# Altium project Capstone_SDR_PLUTOV2.PrjPcb (part 2 of 3)

## Sheet AD9363.SchDoc
size A3; SheetNumber: 6; SheetTotal: 14; SPICEModelCachePHHWHPTQ: <root> / <DocumentId>PHHWHPTQ</DocumentId> / <CacheFrame Number="0"> / <Model Name="emk105bj105_v-f" Kind="CKT"> / <Text>* EMK105BJ105_V-F     SPICE MODEL  ( General Type ) / *-------------------------------------------------------------------------------------------------------- / * Model Generated by TAIYO YUDEN Corporation (http://www.ty-top.com) / * Version 1.0 / * TAIYO YUDEN Control No. 170508_130520 / * Copyright(c) 2012 TAIYO YUDEN CO.,LTD. All Rights Reserved. / *-------------------------------------------------------------------------------------------------------- / * / * Products Name : Multilayer Ceramic Capacitors / * / * Characteristics : / *     Capacitance : 1 uF , Rated Voltage : 16V , TCC : X5R / *     Case Size : 1.0 x 0.5 / 0.039 x 0.02 [mm/inch] , Thickness : 0.5 / 0.02 [mm/inch] / *     (Conditions: Temperature = 25 degC , DC Bias Current/Voltage = 0A / 0V) / * / * Frequency Range : 40Hz - 3GHz / * / * External Node Assignments : / * / *  1  o---| |---o  2 / * / *-------------------------------------------------------------------------------------------------------- / .SubCkt EMK105BJ105_V-F 1 2 / **************************** / C0 1 110 0.68309u / Cm 1 101 0.26053u / C1 101 102 0.94076u / Rc1 101 102 1.9029k / C2 102 103 0.66707u / Rc2 102 103 120.36 / C3 103 110 0.57203u / Rc3 103 110 2.1097 / C2m 1 301 0.1871u / C21 301 302 3.2494u / Rc21 301 302 1.1117k / C22 302 303 2.1014u / Rc22 302 303 1.484k / C23 303 304 2.1172u / Rc23 303 304 1.3876k / C24 304 305 0.75729u / Rc24 304 305 332.59 / C25 305 306 0.94401u / Rc25 305 306 249.09 / C26 306 307 0.34674u / Rc26 306 307 28.352 / C27 307 308 0.37158u / Rc27 307 308 19.989 / C28 308 309 0.17933u / Rc28 308 309 31.748 / C29 309 110 0.016445u / Rc29 309 110 1.0592 / Rp0 1 110 100Meg / L0 110 120 0.2216n / Lm 120 130 0.1509n / L1 120 121 0.12659n / RL1 121 130 0.85161 / L2 120 122 0.15996n / RL2 122 130 0.42469 / L3 120 123 7.9543n / RL3 123 130 0.54643m / CR 120 124 0.24334u / LR 124 125 0.090738n / RR 125 130 68.076m / CL 130 140 2.7354p / LL 130 140 0.10762n / RL 130 140 50.614 / Rs 140 2 7.5416m / **************************** / .ends EMK105BJ105_V-F</Text> / </Model> / </CacheFrame> / </root>
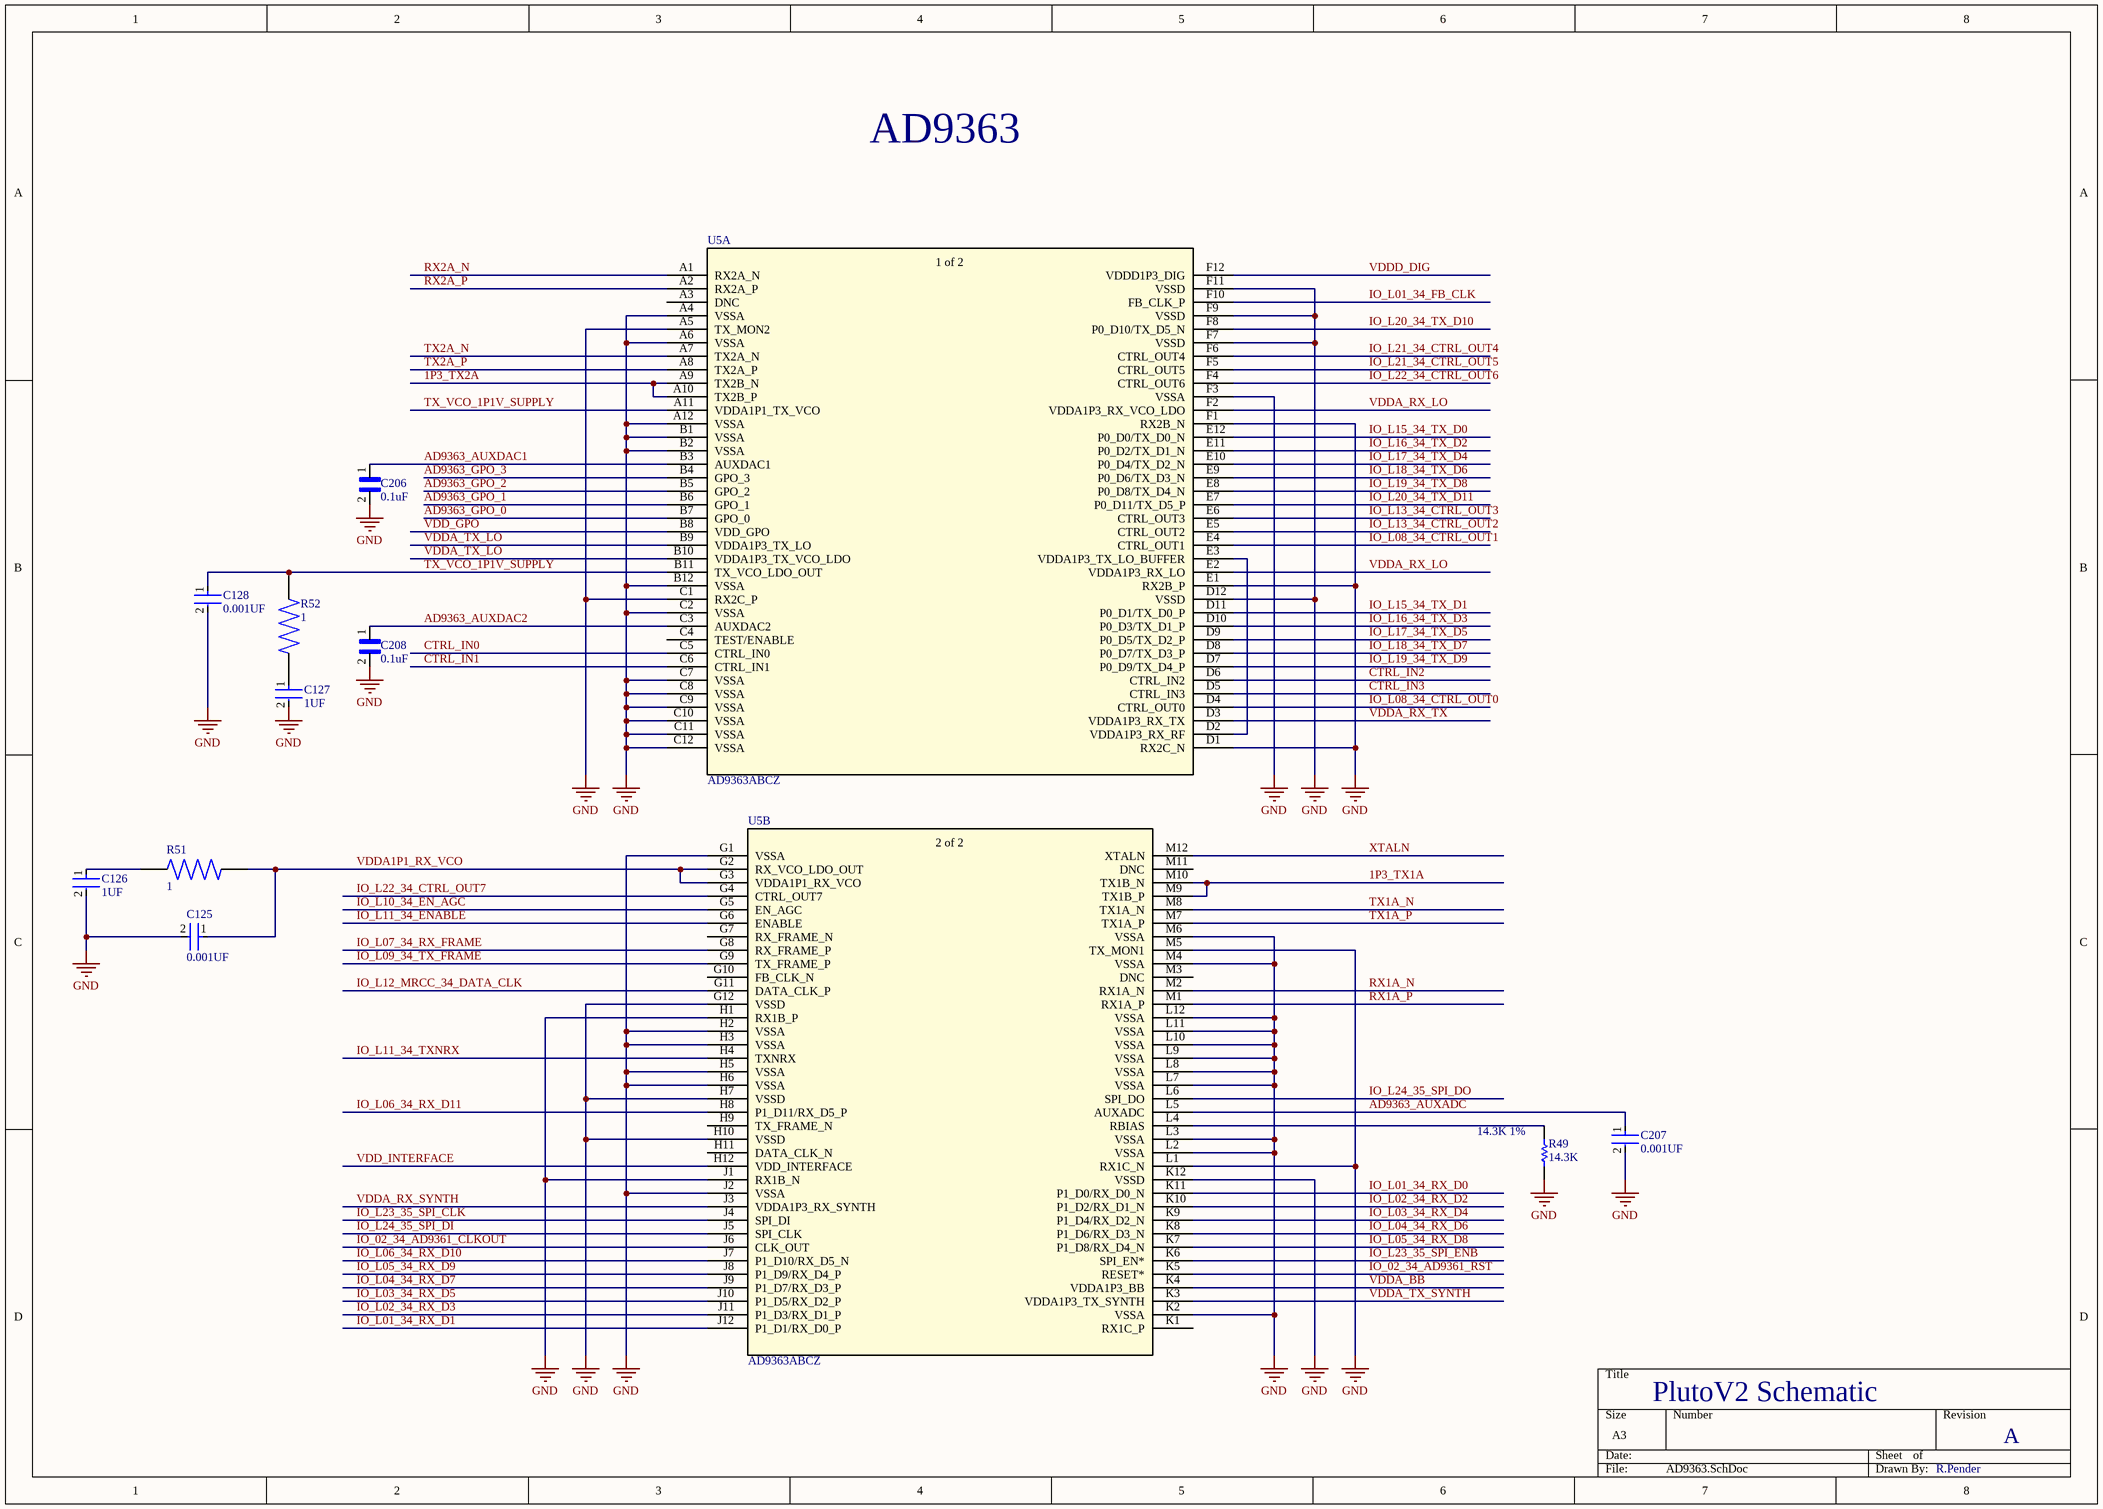
[diagram p5: AD9363.SchDoc]

### Parts
C125  0.001UF  [FP-GRM033-0_03-MFG]
C126  1UF  [FP-0402-L_1_0_0_05-W_0_5-IPC_A]
C127  1UF  [FP-0402-L_1_0_0_05-W_0_5-IPC_A]
C128  0.001UF  [FP-GRM033-0_03-MFG]
C206  0.1uF  [CAPC0603X33N]
C207  0.001UF  [FP-GRM033-0_03-MFG]
C208  0.1uF  [CAPC0603X33N]
R49  14.3K  [RESC0603X26X15NL03T05]
R51  1  [RESC0603X26N]
R52  1  [RESC0603X26N]
U5  AD9363ABCZ  [BGA144C80P12X12_1000X1000X170]  (parts A,B of 2)

### Nets
GND: C125.2 C126.2 C127.2 C128.2 C206.2 C207.2 C208.2 R49.2 U5.A4(VSSA) U5.A5(TX_MON2) U5.A6(VSSA) U5.A12(VSSA) U5.B1(VSSA) U5.B2(VSSA) U5.B12(VSSA) U5.C1(RX2C_P) U5.C2(VSSA) U5.C7(VSSA) U5.C8(VSSA) U5.C9(VSSA) U5.C10(VSSA) U5.C11(VSSA) U5.C12(VSSA) U5.D1(RX2C_N) U5.D12(VSSD) U5.E1(RX2B_P) U5.F1(RX2B_N) U5.F3(VSSA) U5.F7(VSSD) U5.F9(VSSD) U5.F11(VSSD) U5.G1(VSSA) U5.G12(VSSD) U5.H1(RX1B_P) U5.H2(VSSA) U5.H3(VSSA) U5.H5(VSSA) U5.H6(VSSA) U5.H7(VSSD) U5.H10(VSSD) U5.J1(RX1B_N) U5.J2(VSSA) U5.K2(VSSA) U5.K12(VSSD) U5.L1(RX1C_N) U5.L2(VSSA) U5.L3(VSSA) U5.L7(VSSA) U5.L8(VSSA) U5.L9(VSSA) U5.L10(VSSA) U5.L11(VSSA) U5.L12(VSSA) U5.M4(VSSA) U5.M5(TX_MON1) U5.M6(VSSA)
1P3_TX1A: U5.A9(TX2B_N) U5.A10(TX2B_P) U5.F12(VDDD1P3_DIG) U5.J3(VDDA1P3_RX_SYNTH) U5.K4(VDDA1P3_BB) U5.M9(TX1B_P) U5.M10(TX1B_N)  [also labelled 1P3_TX2A, VDDA_BB, VDDA_RX_SYNTH, VDDD_DIG]  [project net 1P3_SUPPLY_B]
AD9363_AUXADC: C207.1 U5.L5(AUXADC)
AD9363_AUXDAC1: C206.1 U5.B3(AUXDAC1)
AD9363_AUXDAC2: C208.1 U5.C3(AUXDAC2)
AD9363_GPO_0: U5.B7(GPO_0)
AD9363_GPO_1: U5.B6(GPO_1)
AD9363_GPO_2: U5.B5(GPO_2)
AD9363_GPO_3: U5.B4(GPO_3)
CTRL_IN0: U5.C5(CTRL_IN0)
CTRL_IN1: U5.C6(CTRL_IN1)
CTRL_IN2: U5.D6(CTRL_IN2)
CTRL_IN3: U5.D5(CTRL_IN3)
IO_02_34_AD9361_CLKOUT: U5.J6(CLK_OUT)
IO_02_34_AD9361_RST: U5.K5(RESET*)
IO_L01_34_FB_CLK: U5.F10(FB_CLK_P)
IO_L01_34_RX_D0: U5.K11(P1_D0/RX_D0_N)
IO_L01_34_RX_D1: U5.J12(P1_D1/RX_D0_P)
IO_L02_34_RX_D2: U5.K10(P1_D2/RX_D1_N)
IO_L02_34_RX_D3: U5.J11(P1_D3/RX_D1_P)
IO_L03_34_RX_D4: U5.K9(P1_D4/RX_D2_N)
IO_L03_34_RX_D5: U5.J10(P1_D5/RX_D2_P)
IO_L04_34_RX_D6: U5.K8(P1_D6/RX_D3_N)
IO_L04_34_RX_D7: U5.J9(P1_D7/RX_D3_P)
IO_L05_34_RX_D8: U5.K7(P1_D8/RX_D4_N)
IO_L05_34_RX_D9: U5.J8(P1_D9/RX_D4_P)
IO_L06_34_RX_D10: U5.J7(P1_D10/RX_D5_N)
IO_L06_34_RX_D11: U5.H8(P1_D11/RX_D5_P)
IO_L07_34_RX_FRAME: U5.G8(RX_FRAME_P)
IO_L08_34_CTRL_OUT0: U5.D4(CTRL_OUT0)
IO_L08_34_CTRL_OUT1: U5.E4(CTRL_OUT1)
IO_L09_34_TX_FRAME: U5.G9(TX_FRAME_P)
IO_L10_34_EN_AGC: U5.G5(EN_AGC)
IO_L11_34_ENABLE: U5.G6(ENABLE)
IO_L11_34_TXNRX: U5.H4(TXNRX)
IO_L12_MRCC_34_DATA_CLK: U5.G11(DATA_CLK_P)
IO_L13_34_CTRL_OUT2: U5.E5(CTRL_OUT2)
IO_L13_34_CTRL_OUT3: U5.E6(CTRL_OUT3)
IO_L15_34_TX_D0: U5.E12(P0_D0/TX_D0_N)
IO_L15_34_TX_D1: U5.D11(P0_D1/TX_D0_P)
IO_L16_34_TX_D2: U5.E11(P0_D2/TX_D1_N)
IO_L16_34_TX_D3: U5.D10(P0_D3/TX_D1_P)
IO_L17_34_TX_D4: U5.E10(P0_D4/TX_D2_N)
IO_L17_34_TX_D5: U5.D9(P0_D5/TX_D2_P)
IO_L18_34_TX_D6: U5.E9(P0_D6/TX_D3_N)
IO_L18_34_TX_D7: U5.D8(P0_D7/TX_D3_P)
IO_L19_34_TX_D8: U5.E8(P0_D8/TX_D4_N)
IO_L19_34_TX_D9: U5.D7(P0_D9/TX_D4_P)
IO_L20_34_TX_D10: U5.F8(P0_D10/TX_D5_N)
IO_L20_34_TX_D11: U5.E7(P0_D11/TX_D5_P)
IO_L21_34_CTRL_OUT4: U5.F6(CTRL_OUT4)
IO_L21_34_CTRL_OUT5: U5.F5(CTRL_OUT5)
IO_L22_34_CTRL_OUT6: U5.F4(CTRL_OUT6)
IO_L22_34_CTRL_OUT7: U5.G4(CTRL_OUT7)
IO_L23_35_SPI_CLK: U5.J4(SPI_DI)
IO_L23_35_SPI_ENB: U5.K6(SPI_EN*)
IO_L24_35_SPI_DI: U5.J5(SPI_CLK)
IO_L24_35_SPI_DO: U5.L6(SPI_DO)
RX1A_N: U5.M2(RX1A_N)
RX1A_P: U5.M1(RX1A_P)
RX2A_N: U5.A1(RX2A_N)
RX2A_P: U5.A2(RX2A_P)
TX1A_N: U5.M8(TX1A_N)
TX1A_P: U5.M7(TX1A_P)
TX2A_N: U5.A7(TX2A_N)
TX2A_P: U5.A8(TX2A_P)
TX_VCO_1P1V_SUPPLY: C128.1 R52.1 U5.A11(VDDA1P1_TX_VCO) U5.B11(TX_VCO_LDO_OUT)
VDD_GPO: U5.B8(VDD_GPO)  [project net 3P3V]
VDD_INTERFACE: U5.H12(VDD_INTERFACE)
VDDA1P1_RX_VCO: C125.1 R51.2 U5.G2(RX_VCO_LDO_OUT) U5.G3(VDDA1P1_RX_VCO)
VDDA_RX_LO: U5.B9(VDDA1P3_TX_LO) U5.B10(VDDA1P3_TX_VCO_LDO) U5.D3(VDDA1P3_RX_TX) U5.E2(VDDA1P3_RX_LO) U5.F2(VDDA1P3_RX_VCO_LDO) U5.K3(VDDA1P3_TX_SYNTH)  [also labelled VDDA_RX_TX, VDDA_TX_LO, VDDA_TX_SYNTH]  [project net 1P3_SUPPLY_A]
XTALN: U5.M12(XTALN)
NetC126_1: C126.1 R51.1
NetC127_1: C127.1 R52.2
NetR49_1: R49.1 U5.L4(RBIAS)
NetU5_D2: U5.D2(VDDA1P3_RX_RF) U5.E3(VDDA1P3_TX_LO_BUFFER)

Not connected (* = marked no-connect by the designer): U5 A3(DNC) C4(TEST/ENABLE) G7(RX_FRAME_N) G10(FB_CLK_N) H9(TX_FRAME_N) H11(DATA_CLK_N) K1(RX1C_P) M3(DNC) M11(DNC)

### Notes on the sheet
- AD9363
- (near R49) 14.3K 1%
- PlutoV2 Schematic
- A
- R.Pender
- (in symbol AD9363ABCZ, part A) 1 of 2
- (in symbol AD9363ABCZ, part B) 2 of 2

### Library data of the parts
C125 C128 C207 = CMP-2010-01706-2: Chip Multilayer Ceramic Capacitors for General Purpose, 0201, 1000pF, X7R, 15%, 10%, 25V; Capacitance: 1nF; Max Operating Temperature: 125°C; Material: Ceramic; Lead Free: Lead Free; Radiation Hardening: No; Dielectric: X7R; Height: 0.3mm; Mount: Surface Mount; Packaging: Tape and Reel; Termination: SMD/SMT; Thickness: 0.013inch; Case Code (Metric): 0603; Tolerance: 10%; Voltage Rating (DC): 25V; REACH SVHC: No SVHC; Package Quantity: 1; Depth: 0.3mm; Voltage: 25V; Case/Package: 0201; Case Code (Imperial): 0201; Voltage Rating: 25V; Min Operating Temperature: -55°C; Length: 0.6mm; Width: 0.012inch
C126 C127 = CMP-14477-000104-2: None; Tolerance: 10%; Voltage Rating: 16V; Dielectric: X5R; Packaging: Tape and Reel; Depth: 0.5mm; Mount: Surface Mount; Thickness: 0.022inch; Package Quantity: 1; Min Operating Temperature: -55°C; Series: M; Voltage Rating (DC): 16V; Termination: SMD/SMT; Case/Package: 0402; Number of Pins: 2; Case Code (Imperial): 0402; Capacitance: 1uF; Length: 1mm; Halogen Free: Halogen Free; Case Code (Metric): 1005; Width: 0.02inch; RoHS Compliant: Yes; Radiation Hardening: No; Max Operating Temperature: 85°C; Height: 0.5mm; Construction: Flat
C206 C208 = GRM033R61C104ME84D: as C46 on sheet USB; Package: None; Price: None; Value: *; MP: GRM033R61C104ME84D; Availability: Unavailable
R49 = CMP-1010-00545-2: Manufacturer: Panasonic; Part Number: ERJ-1GNF1432C
R51 R52 = RMCF0201FT1R00: Package: None; Price: None; Value: *; MP: RMCF0201FT1R00; Availability: Unavailable
U5 = AD9363ABCZ: No Description Available; Mfr_Name: Analog Devices Inc; Copyright: Copyright (C) 2022 Ultra Librarian. All rights reserved.; Manufacturer_Part_Number: AD9363ABCZ; Digi-Key_Part_Number_1: AD9363ABCZ-ND; RefDes: RefDes; Type: DEV

## Sheet RF FRONTEND.SchDoc
size A3; SheetNumber: 7; SheetTotal: 14
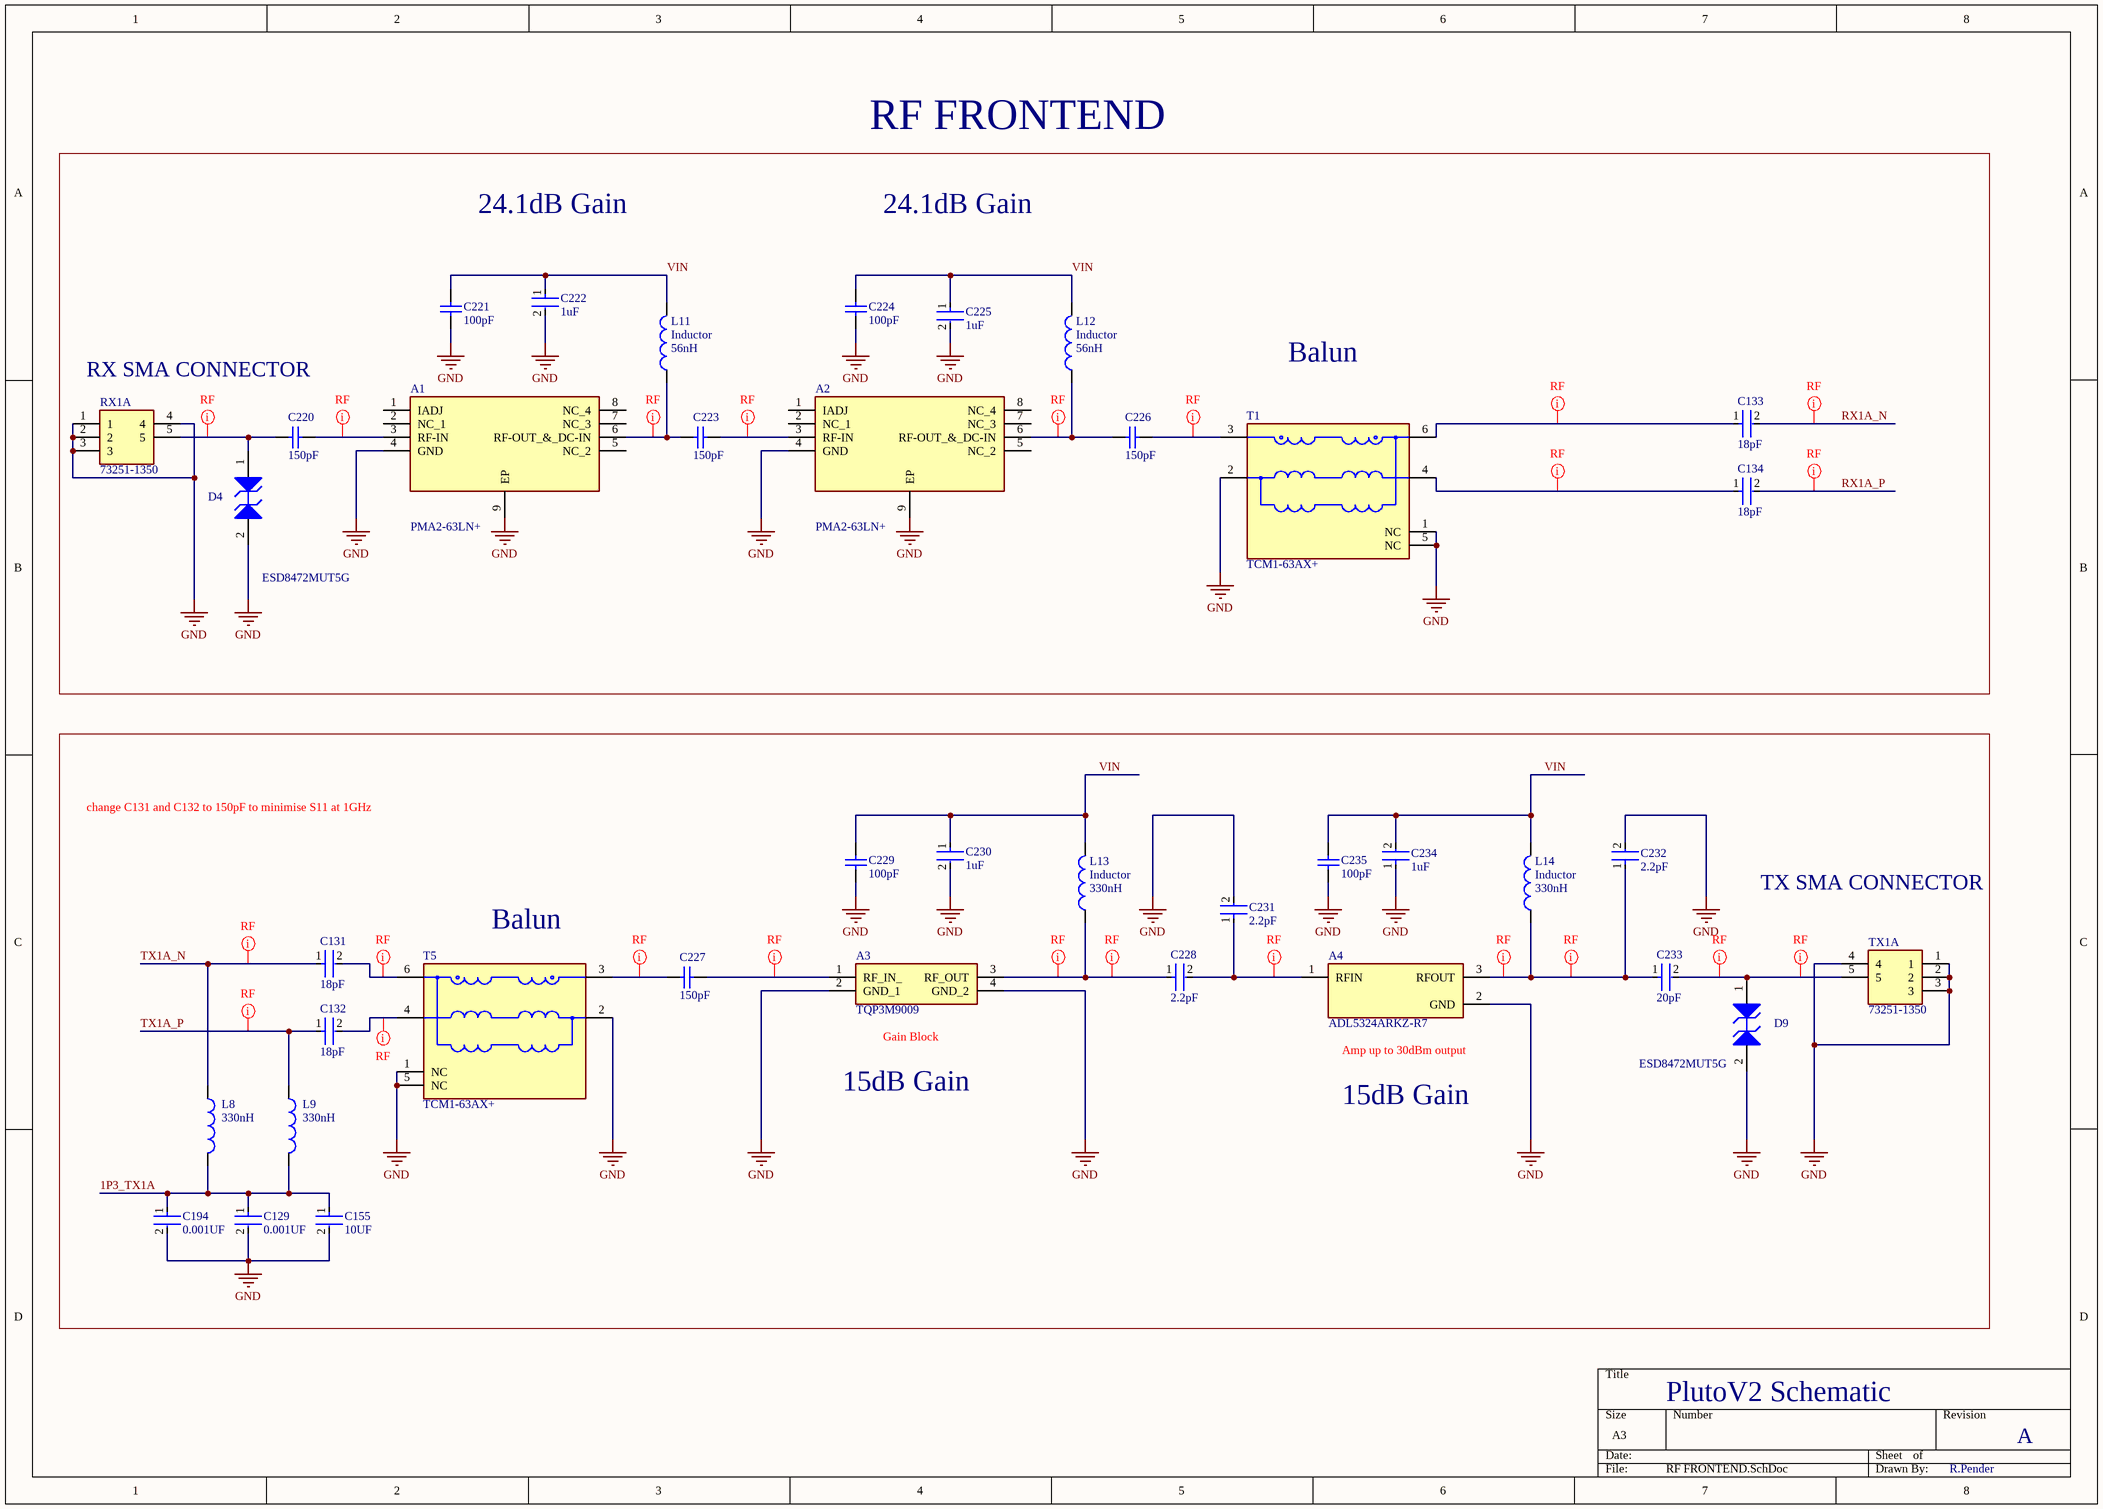
[diagram p6: RF FRONTEND.SchDoc]

### Parts
A1  PMA2-63LN+  [SON50P200X200X105-9N]
A2  PMA2-63LN+  [SON50P200X200X105-9N]
A3  TQP3M9009  [TQP3M9009]
A4  ADL5324ARKZ-R7  [FP-RK-3-MFG]
C129  0.001UF  [FP-GRM033-0_03-MFG]
C131  18pF  [FP-GRM033-0_03-IPC_A]
C132  18pF  [FP-GRM033-0_03-IPC_A]
C133  18pF  [FP-GRM033-0_03-IPC_A]
C134  18pF  [FP-GRM033-0_03-IPC_A]
C155  10UF  [FP-GRM188-0_1-e0_2_0_55-IPC_A]
C194  0.001UF  [FP-GRM033-0_03-MFG]
C220  150pF  [CAPC1005X55X25ML05T10]
C221  100pF  [CAPC1005X55X25ML05T10]
C222  1uF  [FP-GRM155-0_05-IPC_B]
C223  150pF  [CAPC1005X55X25ML05T10]
C224  100pF  [CAPC1005X55X25ML05T10]
C225  1uF  [FP-GRM155-0_05-IPC_B]
C226  150pF  [CAPC1005X55X25ML05T10]
C227  150pF  [CAPC1005X55X25ML05T10]
C228  2.2pF  [FP-GJM155-0_05-MFG]
C229  100pF  [CAPC1005X55X25ML05T10]
C230  1uF  [FP-GRM155-0_05-IPC_B]
C231  2.2pF  [FP-GJM155-0_05-MFG]
C232  2.2pF  [FP-GJM155-0_05-MFG]
C233  20pF  [FP-GJM155-0_05-IPC_C]
C234  1uF  [FP-GRM155-0_05-MFG]
C235  100pF  [CAPC1005X55X25ML05T10]
D4  ESD8472MUT5G  [ONSC-X3DFN-2-152AF-01_V]
D9  ESD8472MUT5G  [ONSC-X3DFN-2-152AF-01_V]
L8  330nH  [0402-A]
L9  330nH  [0402-A]
L11  Inductor  value 56nH  [0402-A]
L12  Inductor  value 56nH  [0402-A]
L13  Inductor  value 330nH  [0402-A]
L14  Inductor  value 330nH  [0402-A]
RX1A  73251-1350  [73251-1350]
T1  TCM1-63AX+  [FP-TCM1-63AX+-MFG]
T5  TCM1-63AX+  [FP-TCM1-63AX+-MFG]
TX1A  73251-1350  [73251-1350]

### Blocks framed on the sheet
RF FRONTEND: A1 A2 C133 C134 C220-C226 D4 L11 L12 RX1A T1

### Nets
GND: A1.4(GND) A1.9(EP) A2.4(GND) A2.9(EP) A3.2(GND_1) A3.4(GND_2) A4.2(GND) C129.2 C155.2 C194.2 C221.2 C222.2 C224.2 C225.2 C229.2 C230.2 C231.2 C232.2 C234.1 C235.1 D4.2(A2) D9.2(A2) RX1A.1 RX1A.2 RX1A.3 RX1A.4 T1.1(NC) T1.2(GND) T1.5(NC) T5.1(NC) T5.2(GND) T5.5(NC) TX1A.1 TX1A.2 TX1A.3 TX1A.4
1P3_TX1A: C129.1 C155.1 C194.1 L8.2 L9.2  [project net 1P3_SUPPLY_B]
RX1A_N: C133.2
RX1A_P: C134.2
TX1A_N: C131.1 L8.1
TX1A_P: C132.1 L9.1
VIN: C221.1 C222.1 C224.1 C225.1 C229.1 C230.1 C234.2 C235.2 L11.2 L12.2 L13.2 L14.2
NetA1_3: A1.3(RF-IN) C220.2
NetA1_6: A1.6(RF-OUT_&_DC-IN) C223.1 L11.1
NetA2_3: A2.3(RF-IN) C223.2
NetA2_6: A2.6(RF-OUT_&_DC-IN) C226.1 L12.1
NetA3_1: A3.1(RF_IN_) C227.2
NetA3_3: A3.3(RF_OUT) C228.1 L13.1
NetA4_1: A4.1(RFIN) C228.2 C231.1
NetA4_3: A4.3(RFOUT) C232.1 C233.1 L14.1
NetC131_2: C131.2 T5.6(SECONDARY_DOT)
NetC132_2: C132.2 T5.4(SECONDARY)
NetC133_1: C133.1 T1.6(SECONDARY_DOT)
NetC134_1: C134.1 T1.4(SECONDARY)
NetC220_1: C220.1 D4.1(A1) RX1A.5
NetC226_2: C226.2 T1.3(PRIMARY_DOT)
NetC227_1: C227.1 T5.3(PRIMARY_DOT)
NetC233_2: C233.2 D9.1(A1) TX1A.5

Not connected (* = marked no-connect by the designer): A1 1(IADJ) 2(NC_1) 5(NC_2) 7(NC_3) 8(NC_4); A2 1(IADJ) 2(NC_1) 5(NC_2) 7(NC_3) 8(NC_4)

### Layout directives
net class RF: NetA1_3, NetA1_6, NetA2_3, NetA2_6, NetA3_1, NetA3_3, NetA4_1, NetA4_3, NetC131_2, NetC132_2, NetC133_1, NetC134_1, NetC220_1, NetC226_2, NetC227_1, NetC233_2, RX1A_N, RX1A_P, TX1A_N, TX1A_P

### Notes on the sheet
- 24.1dB Gain
- RX SMA CONNECTOR
- Balun
- change C131 and C132 to 150pF to minimise S11 at 1GHz
- TX SMA CONNECTOR
- (near T5) Balun
- (near A3) Gain Block
- (near A4) Amp up to 30dBm output
- 15dB Gain
- PlutoV2 Schematic
- A
- R.Pender

### Library data of the parts
A1 A2 = PMA2-63LN+: Integrated Circuit; Manufacturer_Name: Mini-Circuits; Datasheet Link: https://www.minicircuits.com/pdfs/PMA2-63LN+.pdf; Height: 1.05mm; Manufacturer_Part_Number: PMA2-63LN+
A3 = TQP3M9009: Integrated Circuit; Manufacturer_Name: Qorvo; Datasheet Link: https://componentsearchengine.com/Datasheets/1/TQP3M9009.pdf; Height: 1.6mm; Manufacturer_Part_Number: TQP3M9009
A4 = CMP-09142-000062-1: IC AMP ISM 400MHZ-4GHZ SOT89-3; Min Supply Voltage: 3.15V; Gain: 14.6dB; P1dB: 29.1dBm; Frequency: 4GHz; Operating Supply Current: 133mA; Number of Channels: 1; Max Supply Voltage: 5.25V; Operating Frequency: 400 MHz to 4000 MHz; Test Frequency: 2.14GHz; Min Frequency: 400MHz; Noise Figure: 3.8dB; Operating Supply Voltage: 5V; Max Power Dissipation: 1.9W; Series: -; Packaging: Tape and Reel; REACH SVHC: No SVHC; Max Frequency: 4GHz; Radiation Hardening: No; Contact Plating: Tin; Number of Pins: 3; Lead Free: Contains Lead; Nominal Supply Current: 133mA; Package Quantity: 1; Min Operating Temperature: -40°C; RoHS Compliant: Yes; Max Operating Temperature: 105°C; Case/Package: SOT-89; Mount: Surface Mount; Supply Current: 133mA
C129 C194 = CMP-2010-01706-2: as C125 on sheet AD9363; Max Operating Temperature: 125°C; Material: Ceramic; Lead Free: Lead Free; Radiation Hardening: No; Dielectric: X7R; Height: 0.3mm; Mount: Surface Mount; Packaging: Tape and Reel; Termination: SMD/SMT; Thickness: 0.013inch; Case Code (Metric): 0603; Tolerance: 10%; Voltage Rating (DC): 25V; REACH SVHC: No SVHC; Package Quantity: 1; Depth: 0.3mm; Voltage: 25V; Case/Package: 0201; Case Code (Imperial): 0201; Voltage Rating: 25V; Min Operating Temperature: -55°C; Length: 0.6mm; Width: 0.012inch
C131-C134 = CMP-2010-01507-2: Chip Multilayer Ceramic Capacitors for General Purpose, 0201, 18pF, C0G, 30ppm/°C, 5%, 50V; Max Operating Temperature: 125°C; Case Code (Metric): 0603; Case Code (Imperial): 0201; Capacitance: 18pF; Voltage Rating (DC): 50V; Lead Free: Lead Free; Mount: Surface Mount; Radiation Hardening: No; Height: 0.3mm; Package Quantity: 15000; Depth: 0.3mm; Tolerance: 5%; Thickness: 0.013inch; Width: 0.3mm; Packaging: Tape and Reel; Voltage Rating: 50V; Dielectric: C0G; Length: 0.6mm; Termination: SMD/SMT; Min Operating Temperature: -55°C; Case/Package: 0201; Voltage: 50V
C155 = CMP-2006-02792-2: as C79 on sheet DDR3; Packaging: Tape and Reel; Voltage Rating (DC): 6.3V; Width: 0.031inch; Termination: SMD/SMT; Dielectric: X5R; Package Quantity: 4000; Voltage Rating: 6.3V; Capacitance: 10uF; Case/Package: 0603; Min Operating Temperature: -55°C; Voltage: 6.3V; Length: 1.6mm; Thickness: 0.035inch; Lead Free: Lead Free; Depth: 0.8mm; Case Code (Imperial): 0603; Max Operating Temperature: 85°C; Material: Ceramic; Height: 0.8mm; Tolerance: 20%; Mount: Surface Mount; REACH SVHC: No SVHC; Radiation Hardening: No; Case Code (Metric): 1608
C220 C223 C226 C227 = CMP-2008-04269-1: Manufacturer: Murata; Part Number: GRM1555C1H151JA01D
C221 C224 C229 C235 = CMP-2008-03915-1: Manufacturer: Murata; Part Number: GRM1555C1H101JA01D
C222 C225 C230 = CMP-2008-04581-2: Chip Multilayer Ceramic Capacitors for General Purpose, 0402, 1.0uF, X5R, 15%, 10%, 25V; Height: 0.5mm; Voltage: 25V; Tolerance: 10%; Termination: SMD/SMT; Dielectric: X5R; REACH SVHC: No SVHC; Case Code (Imperial): 0402; Max Operating Temperature: 85°C; Lead Free: Lead Free; Case/Package: 0402; Mount: Surface Mount; Width: 0.5mm; Weight: 0.000212oz; Min Operating Temperature: -55°C; Voltage Rating (DC): 25V; Length: 1mm; Thickness: 0.022inch; Voltage Rating: 25V; Material: Ceramic; Case Code (Metric): 1005; Package Quantity: 10000; Packaging: Tape and Reel; Depth: 0.5mm; Capacitance: 1uF
C228 C231 C232 = CMP-2008-03835-2: Multi-Layer Ceramic Capacitor 2.2pF C0G  ±0.1pF 0402 Paper T/R; Voltage Rating: 50V; Temperature Coefficient: 30ppm/°C; Width: 0.5mm; Dielectric: C0G; Mount: Surface Mount; Thickness: 0.022inch; Lead Pitch: 0.3mm; Depth: 0.5mm; Case Code (Metric): 1005; Lead Free: Lead Free; Min Operating Temperature: -55°C; Number of Pins: 2; Radiation Hardening: No; Case/Package: 0402; Voltage: 50V; Max Operating Temperature: 125°C; Height: 0.5mm; Package Quantity: 10000; Capacitance: 2.2pF; REACH SVHC: No SVHC; Packaging: Tape and Reel; Case Code (Imperial): 0402; Termination: SMD/SMT; Voltage Rating (DC): 50V; Length: 1mm
C233 = CMP-2008-03828-2: Multi-Layer Ceramic Capacitor 20pF C0G  ±2% 0402 Paper T/R; Voltage Rating: 50V; Case Code (Metric): 1005; Case/Package: 0402; Termination: SMD/SMT; Thickness: 0.022inch; Case Code (Imperial): 0402; Lead Free: Lead Free; Package Quantity: 10000; Voltage Rating (DC): 50V; Radiation Hardening: No; Mount: Surface Mount; Width: 0.5mm; Capacitance: 20pF; Dielectric: C0G; Min Operating Temperature: -55°C; Depth: 0.5mm; Tolerance: 2%; Packaging: Tape and Reel; Height: 0.5mm; Max Operating Temperature: 125°C; Length: 1mm
C234 = CMP-06035-029125-1: Chip Multilayer Ceramic Capacitors for General Purpose, 0402, 1.0uF, X5R, 15%, 10%, 25V; Max Operating Temperature: 85°C; Capacitance: 1uF; Case/Package: 0402; Voltage Rating: 25V; Length: 0.039inch; Thickness: 0.022inch; Min Operating Temperature: -55°C; Voltage Rating (DC): 25V; Tolerance: 10%; Mount: Surface Mount; Width: 0.02inch; Dielectric: X5R; Packaging: Tape and Reel
D4 D9 = CMP-1063-00281-1: Ultra-Low Capacitance ESD Protection, Micro-Packaged Diode for ESD Protection, 2-Pin X3DFN, Pb-Free, Tape and Reel; Manufacturer: On Semiconductor; IR Max (uA): 0.05; C Max (pF): 0.3; V(BR) Min (V): 7; VRWM Max (V): 5.3; Number of Lines: 1; Direction: Bidirectional; PartNumber: ESD8472MUT5G; PackageVersion: Rev. O, 04/2011; RoHS: Pb-Free; PackageDescription: 2-Pin Small Outline No-Lead, Body 0.62 x 0.32 mm, Pitch 0.355 mm; ComponentLink1Description: Manufacturer URL; ComponentLink1URL: http://www.onsemi.com/; Packing: Tape and Reel; Mounting Technology: Surface Mount; PackageReference: X3DFN-2-152AF-01; ComponentLink3Description: Package Specification; ComponentLink2Description: Datasheet; ComponentLink3URL: http://www.onsemi.cn/pub_link/Collateral/152AF.PDF; DatasheetVersion: Rev. 4; ComponentLink2URL: http://www.onsemi.cn/pub_link/Collateral/ESD8472-D.PDF
L8 L9 = Inductor: Code_IEC: 1005; Value: 10mH; Published: 8-Jun-2000; LatestRevisionDate: 29-May-2009; LatestRevisionNote: IPC-7351 Footprint Added.; PackageReference: 0402-A; Publisher: Altium Limited; PackageDescription: Chip Inductor; Code_JEITA: 0402
L11-L14 = Inductor: Code_IEC: 1005; Published: 8-Jun-2000; LatestRevisionDate: 29-May-2009; LatestRevisionNote: IPC-7351 Footprint Added.; PackageReference: 0402-A; Publisher: Altium Limited; PackageDescription: Chip Inductor; Code_JEITA: 0402
RX1A TX1A = 73251-1350: Connector; Manufacturer_Name: Molex; Datasheet Link: https://datasheet.datasheetarchive.com/originals/distributors/Datasheets_SAMA/a7fe410725d15196979040a6ba638a6a.pdf; Manufacturer_Part_Number: 73251-1350
T1 T5 = CMP-199822-000001-1: 1:1 CORE & WIRE Transformer, 10 - 6000 MHz, 50Ω; Manufacturer: Mini-Circuits; Insertion Loss: 1.16-1.8dB; Return Loss: 9.42-16.9dB; Lead Free: Yes; Device Class L3: unset; Temperature: -40°C to +85°C; Manufacturer Part Number: TCM1-63AX+; Frequency: 10-6000MHz; Device Class L2: Transformers; RoHS: TRUE; Octopart: https://octopart.com/tcm1-63ax%2B-mini-circuits-107315723; Temperature Range Low: -40°C; Category: Trans; Package: 0; ComponentLink2URL: https://www.minicircuits.com/pdfs/TCM1-63AX+.pdf; ComponentLink2Description: Datasheet; Automotive: No; Height: 4.06mm; Device Class L1: Passive Components; Temperature Range High: +85°C; Turns Ratio: 1:1

## Sheet CONNECTORS_SELECTORS.SchDoc
size A3; SheetNumber: 8; SheetTotal: 14
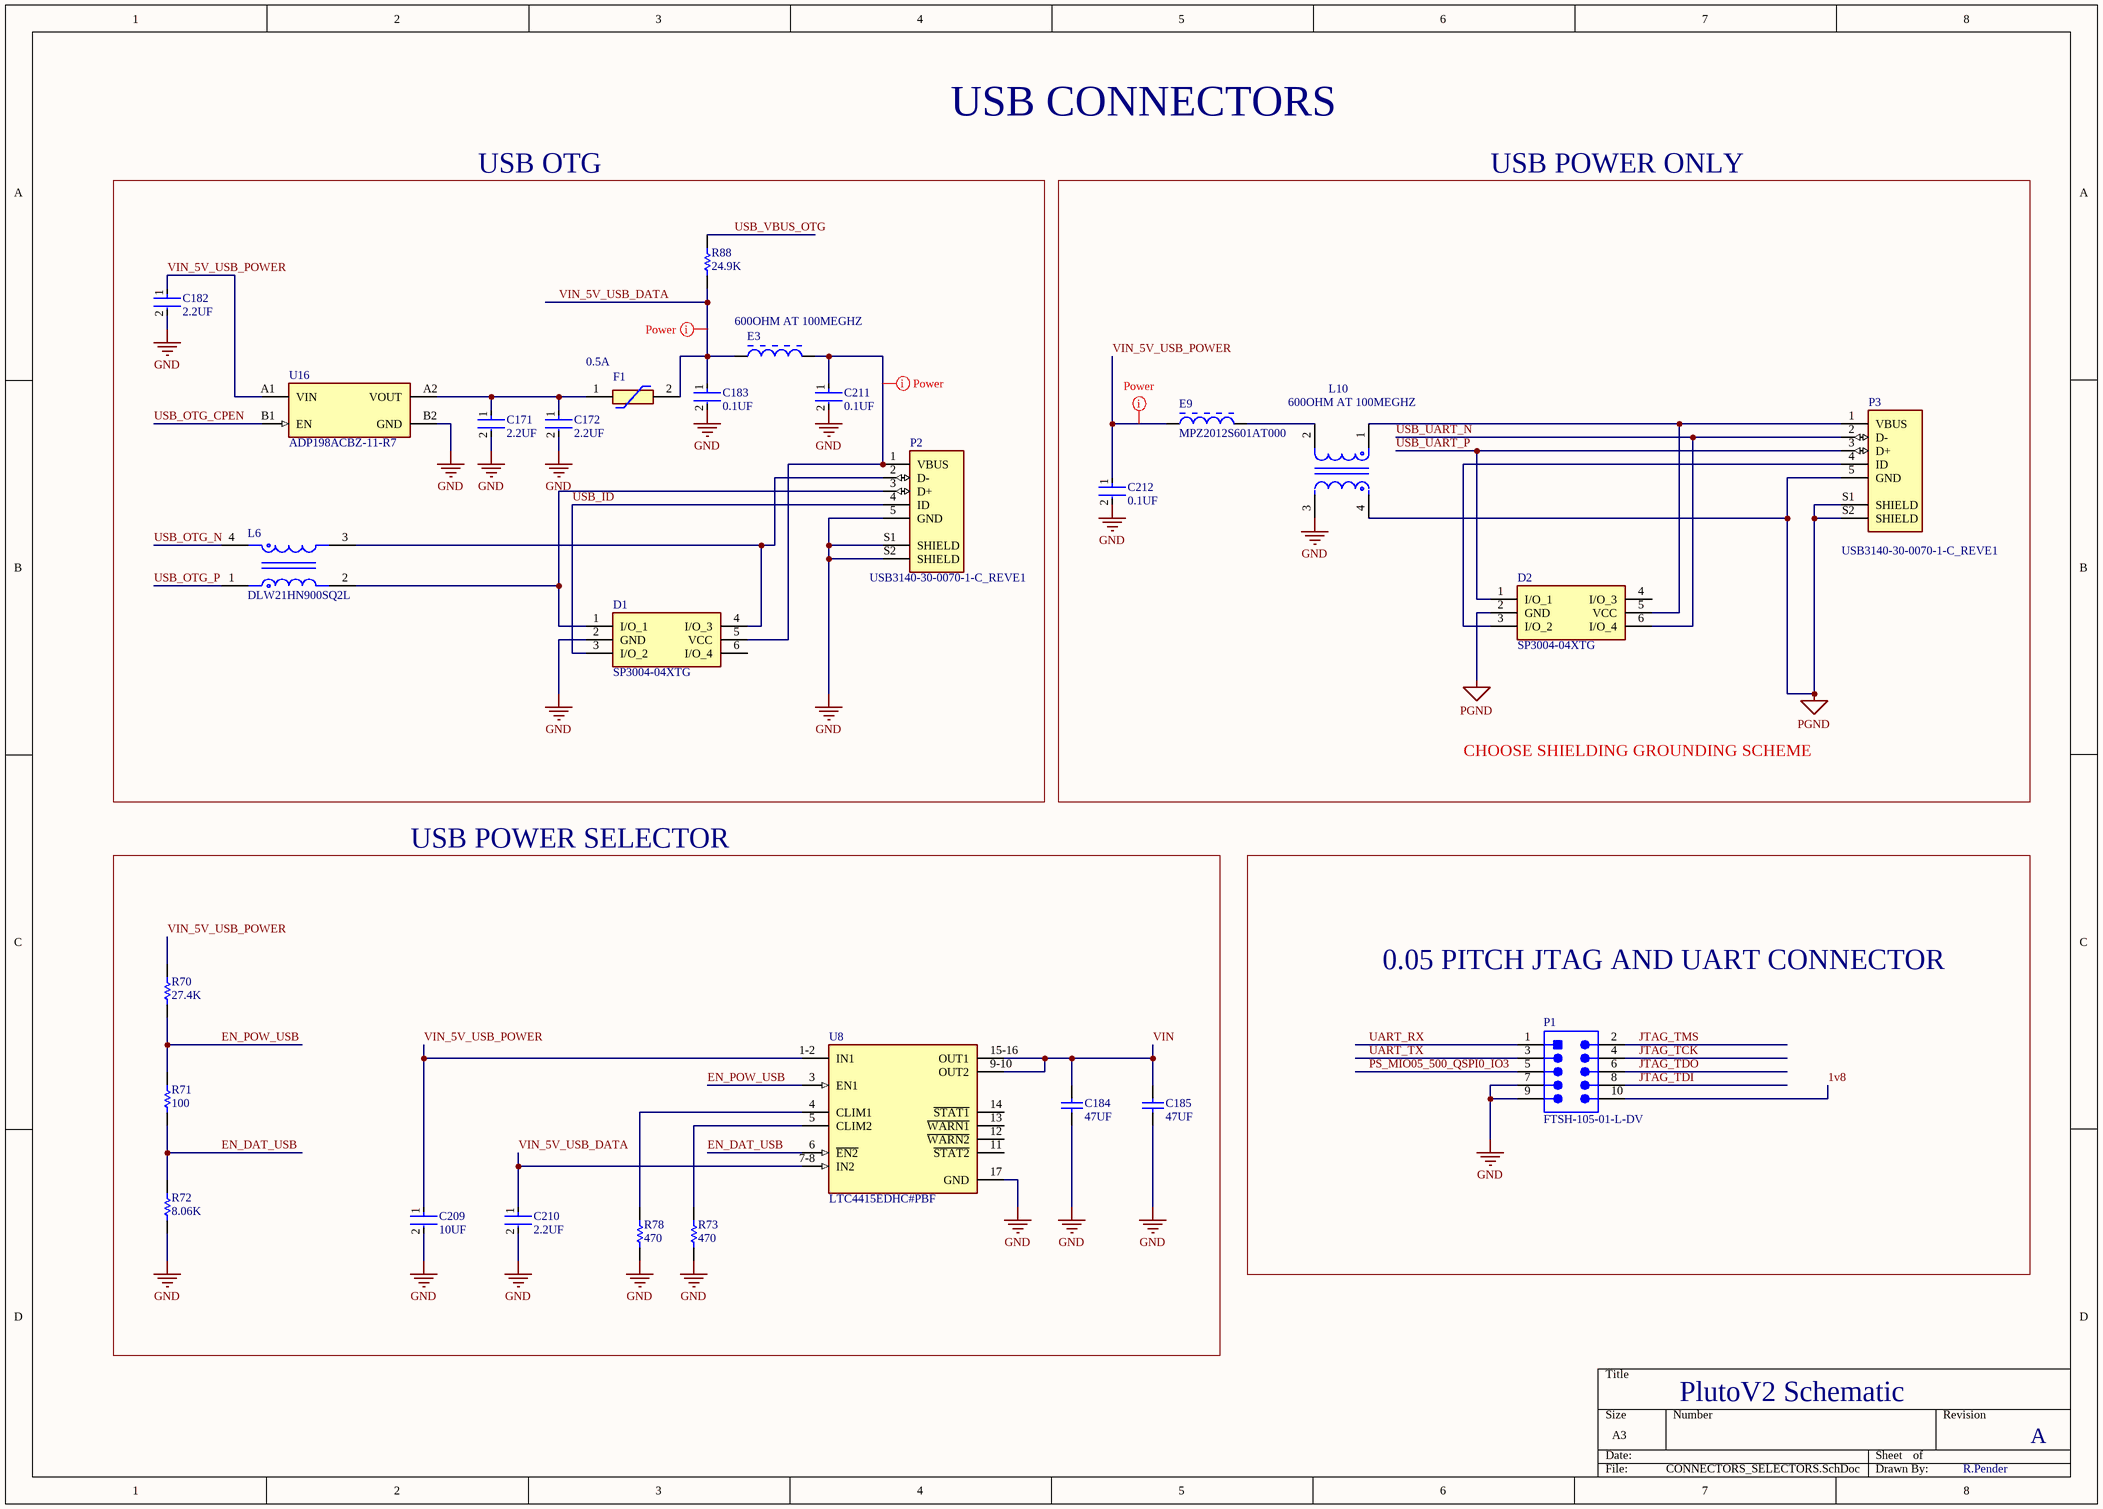
[diagram p7: CONNECTORS_SELECTORS.SchDoc]

### Parts
C171  2.2UF  [FP-GRM188-0_2-IPC_C]
C172  2.2UF  [FP-GRM188-0_2-IPC_C]
C182  2.2UF  [FP-GRM188-0_2-IPC_C]
C183  0.1UF  [FP-CL10-IPC_A]
C184  47UF  [TAYO-JMK212BBJ476MG-T_L]
C185  47UF  [TAYO-JMK212BBJ476MG-T_L]
C209  10UF  [FP-GRM188-0_15-MFG]
C210  2.2UF  [FP-GRM188-0_2-IPC_C]
C211  0.1UF  [FP-CL10-IPC_A]
C212  0.1UF  [FP-CL10-IPC_A]
D1  SP3004-04XTG  [SOTFL50P160X60-6N]
D2  SP3004-04XTG  [SOTFL50P160X60-6N]
E3  600OHM AT 100MEGHZ  [TDK-MPZ2012_V]
E9  MPZ2012S601AT000  [TDK-MPZ2012_V]
F1  0.5A  [0402L010SLKR]
L6  DLW21HN900SQ2L  [FP-DLW21HN-MFG]
L10  600OHM AT 100MEGHZ  [FP-DLW5BS-MFG]
P1  FTSH-105-01-L-DV  [SMTC-FTSH-105-01-L-DV_V]
P2  USB3140-30-0070-1-C_REVE1  [GCT_USB3140-30-0070-1-C_REVE1]
P3  USB3140-30-0070-1-C_REVE1  [GCT_USB3140-30-0070-1-C_REVE1]
R70  27.4K  [2-0402]
R71  100  [2-0402]
R72  8.06K  [2-0402]
R73  470  [RESC1005X40X25ML05T10]
R78  470  [RESC1005X40X25ML05T10]
R88  24.9K  [2-0402]
U8  LTC4415EDHC#PBF  [FP-DHC-16-05-08-1872-MFG]
U16  ADP198ACBZ-11-R7  [FP-CB-4-4-MFG]

### Blocks framed on the sheet
USB OTG: C171 C172 C182 C183 C211 D1 E3 F1 L6 P2 R88 U16
USB POWER ONLY: C212 D2 E9 L10 P3
USB POWER SELECTOR: C184 C185 C209 C210 R70-R73 R78 U8
0.05 PITCH JTAG AND UART CONNECTOR: P1

### Nets
GND: C171.2 C172.2 C182.2 C183.2 C184.2 C185.2 C209.2 C210.2 C211.2 C212.2 D1.2(GND) L10.3 P1.7 P1.9 P2.5(GND) P2.S1(SHIELD) P2.S2(SHIELD) R72.2 R73.2 R78.2 U8.17(GND) U16.B2(GND)
PGND: D2.2(GND) L10.4 P3.5(GND) P3.S1(SHIELD) P3.S2(SHIELD)
1v8: P1.10
EN_DAT_USB: R71.2 R72.1 U8.6(~{EN2})
EN_POW_USB: R70.2 R71.1 U8.3(EN1)
JTAG_TCK: P1.4
JTAG_TDI: P1.8
JTAG_TDO: P1.6
JTAG_TMS: P1.2
PS_MIO05_500_QSPI0_IO3: P1.5
UART_RX: P1.1
UART_TX: P1.3
USB_ID: D1.3(I/O_2) P2.4(ID)
USB_OTG_CPEN: U16.B1(EN)
USB_OTG_N: L6.4
USB_OTG_P: L6.1
USB_UART_N: D2.6(I/O_4) P3.2(D-)
USB_UART_P: D2.1(I/O_1) P3.3(D+)
USB_VBUS_OTG: R88.2
VIN: C184.1 C185.1 U8.9-10(OUT2) U8.15-16(OUT1)
VIN_5V_USB_DATA: C183.1 C210.1 E3.1 F1.2 R88.1 U8.7-8(IN2)
VIN_5V_USB_POWER: C182.1 C209.1 C212.1 E9.1 R70.1 U8.1-2(IN1) U16.A1(VIN)
NetC171_1: C171.1 C172.1 F1.1 U16.A2(VOUT)
NetC211_1: C211.1 D1.5(VCC) E3.2 P2.1(VBUS)
NetD1_1: D1.1(I/O_1) L6.2 P2.3(D+)
NetD1_4: D1.4(I/O_3) L6.3 P2.2(D-)
NetD2_3: D2.3(I/O_2) P3.4(ID)
NetD2_5: D2.5(VCC) L10.1 P3.1(VBUS)
NetE9_2: E9.2 L10.2
NetR73_1: R73.1 U8.5(CLIM2)
NetR78_1: R78.1 U8.4(CLIM1)

Not connected (* = marked no-connect by the designer): D1 6(I/O_4); D2 4(I/O_3); U8 11(~{STAT2}) 12(~{WARN2}) 13(~{WARN1}) 14(~{STAT1})

### Layout directives
net class Power: NetC211_1, VIN_5V_USB_DATA, VIN_5V_USB_POWER

### Notes on the sheet
- USB CONNECTORS
- CHOOSE SHIELDING GROUNDING SCHEME
- PlutoV2 Schematic
- A
- R.Pender

### Library data of the parts
C171 C172 C182 C210 = CMP-06035-023692-1: Chip Multilayer Ceramic Capacitors for General Purpose, 0603, 2.2uF, X5R, 15%, 10%, 50V; Mount: Surface Mount; Case/Package: 0603; Voltage Rating (DC): 50V; Weight: 0.000222oz; Capacitance: 2.2uF; Max Operating Temperature: 85°C; Length: 0.063inch; Thickness: 0.039inch; Dielectric: X5R; Min Operating Temperature: -55°C; Termination: SMD/SMT; Resistor Type: Ceramic; Width: 0.8mm; Voltage Rating: 50V; Height: 0.8mm; Tolerance: 10%; Case Code (Metric): 1608; Package Quantity: 10000; Packaging: Tape and Reel; Case Code (Imperial): 0603
C183 C211 C212 = CMP-13271-004036-1: Cap Ceramic 100nF 100V X7R ±10% Pad SMD 0603 +125°C T/R; Mount: Surface Mount; Packaging: Cut Tape; Width: 0.031inch; Thickness: 0.035inch; Length: 0.063inch; Tolerance: 10%; Min Operating Temperature: -55°C; Case/Package: 0603; Voltage Rating: 100V; Max Operating Temperature: 125°C; Case Code (Metric): 1608; Capacitance: 100nF; Case Code (Imperial): 0603
C184 C185 = CMP-2000-06498-1: as C65 on sheet ZYNQ JTAG and Decoupling; Operating Temperature: -55°C~85°C; Mounting Technology: SurfaceMount; Package Reference: 0805; Features: -; Lead Spacing: -; Lead Style: -; Family: CeramicCapacitors; Size / Dimension: 0.079"Lx0.049"W(2.00mmx1.25mm); Package Description: 2-Pin SMD, Body 2.2 x 1.45 mm; Mounting Type: SurfaceMount,MLCC; Package / Case: 0805(2012Metric); Series: M; Category: Capacitors; Packaging: CutTape(CT); Datasheet Version: 10/2015; Datasheet URL: http://datasheet.octopart.com/JMK212BJ476MG-T-Taiyo-Yuden-datasheet-62109412.pdf; Manufacturer URL: http://www.t-yuden.com/; Ratings: -; Height - Seated (Max): -; Standard Package: 1; Thickness (Max): 0.053"(1.35mm); Applications: GeneralPurpose
C209 = CMP-06035-003612-1: Chip Multilayer Ceramic Capacitors for General Purpose, 0603, 10uF, X5R, 15%, 20%, 10V; Tolerance: 20%; Dielectric: X5R; Package Quantity: 4000; Width: 0.8mm; Case/Package: 0603; Thickness: 0.035inch; Capacitance: 10uF; Voltage Rating: 10V; Voltage Rating (DC): 10V; Termination: SMD/SMT; Length: 1.6mm; Lead Free: Lead Free; Mount: Surface Mount; Height: 0.8mm; Depth: 0.8mm; Packaging: Tape and Reel; Weight: 0.000222oz; Min Operating Temperature: -55°C; Case Code (Metric): 1608; Max Operating Temperature: 85°C; Case Code (Imperial): 0603; Material: Ceramic
D1 D2 = SP3004-04XTG: TVS Diode (Uni-directional); Manufacturer_Name: LITTELFUSE; Datasheet Link: https://m.littelfuse.com/~/media/electronics/datasheets/tvs_diode_arrays/littelfuse_tvs_diode_array_sp3004_datasheet.pdf.pdf; Height: 0.6mm; Manufacturer_Part_Number: SP3004-04XTG
E3 E9 = CMP-2000-05401-1: Chip Bead, 0.1 Ohm, 2 A, -55 to 125 degC, 2-Pin SMD (0805), RoHS, Tape and Reel; PCN Part Number: MMZ,MPSSeriesOct/2014; Manufacturer: TDK; Impedance @ Frequency: 600Ohm@100MHz; Other Names: 445-2206-6; Catalog Drawings: (MMZ,MPZ)2012SeriesTop / (MMZ,MPZ)2012SeriesFootprint / (MMZ,MPZ)2012SeriesSide; DC Resistance (DCR): 100mOhmMax; Current Rating: 2A; Product Training Modules: EMCComponents; Filter Type: DifferentialMode-Single; Online Catalog: MPZ2012Series; Datasheet URL: http://datasheet.octopart.com/MPZ2012S601AT000-TDK-datasheet-12512619.pdf; Size / Dimension: 0.079"Lx0.049"W(2.00mmx1.25mm); Package Reference: 805; Package / Case: 0805(2012Metric); Packaging: Digi-Reel; Mounting Type: SurfaceMount; Family: FerriteBeadsandChips; Category: Filters; Height (Max): 0.041"(1.05mm); Datasheet Version: Sep-12; Manufacturer URL: http://www.tdk.com/; Series: MPZ; Package Description: 2-Pin Surface Mount Device, Body 2 x 1.25 mm; Standard Package: 1
F1 = 0402L050SLKR: Resettable Fuse; Manufacturer_Name: LITTELFUSE; Datasheet Link: https://g.componentsearchengine.com/Datasheets/1/0402L010SLKR.pdf; Height: 0.6mm; Manufacturer_Part_Number: 0402L050SLKR
L6 = CMP-06045-000050-1: CMC 330MA 2LN 90 OHM SMD; Tolerance: 25%; Frequency: 100MHz; Shielding: Unshielded; Impedance: 90R; Number of Lines: 2; DC Resistance (DCR): 350mR; Voltage Rating: 50V; DC Current: 330mA; Current Rating: 330mA; Lead Free: Lead Free; Length: 2mm; Radiation Hardening: No; Max Operating Temperature: 85°C; Depth: 1.2mm; Weight: 0.000317oz; Height: 0.9mm; Termination: SMD/SMT; Min Operating Temperature: -40°C; Case/Package: 0805; Packaging: Tape and Reel; Width: 0.047inch; Test Frequency: 100MHz; Mount: Surface Mount; Current: 330mA; Military Standard: Not; Package Quantity: 1; Resistor Type: Wirewound; Case Code (Imperial): 0805; Max DC Current: 330mA
L10 = CMP-06045-000287-1: Common Mode Choke, 2020, 800Ω @ 100MHz, 0.056Ω, 40%, 2A; Number of Lines: 2; Impedance: 800R; DC Resistance (DCR): 56mR; Voltage Rating (DC): 50V; Tolerance: 40%; Package Quantity: 400; Max Current Rating: 2A; Termination: Wire; Max Operating Temperature: 105°C; Height: 0.197inch; Width: 5mm; Mount: Surface Mount; Case/Package: 2020; Weight: 0.010582oz; Length: 5mm; Max DC Current: 2A; Min Operating Temperature: -40°C; Packaging: Tape and Reel
P1 = CMP-2000-05354-1: Male Header, Pitch 1.27 mm, 2 x 5 Position, Height 5.96 mm, -55 to 125 degC, RoHS, Bulk; Manufacturer: Samtec; Connector Type: Header,Unshrouded; Pitch: 0.050"(1.27mm); Mating Products: FLE-105-01-G-DV-TR-ND-CONNSKT1.27MM10POSDUALSMDCLP-105-02-G-D-P-TR-ND-CONNRCPT10POSDUAL.05"SMDSFMC-105-L2-S-D-TR-ND-CONN.05"SURFACE10POSSMTSFMH-105-02-L-D-TR-ND-CONNRECEPT10POS.50"SMTFLE-105-01-G-DV-A-ND-CONNSKT1.27MM10POSDUALSMDCLP-105-02-G-D-BE-ND-CONNRCPT10POSDUAL.05"SMDFLE-105-01-G-DV-A-P-ND-CONNSKT1.27MM10POSDUALSMDSAM1153-05-ND-CONNRCPT10POSDUAL.05"SMDSAM1155-05-ND-CONNRCPT10POSDUAL.05"SMDSAM1154-05-ND-CONNRCPT10POSDUAL.05"SMDSFMH-105-02-L-D-LC-ND-CONNRECEPT10POS.50"SMTSAM1226-05-ND-CONNRCPT.05"10POSDUALSMD; Catalog Drawings: FTSHSeriesFTSHSeriesSMTSide; Other Names: SAM1161-05; EDA / CAD Models: DownloadfromAcceleratedDesigns; Number of Positions Loaded: All; Number of Positions: 10; Featured Product: Board-To-BoardInterconnectSystems; Online Catalog: FTSHSeries; Product Training Modules: Board-to-BoardConnectors; Category: Connectors,Interconnects; Number of Rows: 2; Contact Finish: Gold; Termination: Solder; Mounting Type: SurfaceMount; Series: FTSH; Contact Mating Length: 0.120"(3.05mm); Row Spacing: 0.050"(1.27mm); Datasheet URL: https://datasheet.ciiva.com/30493/0900766b80adfe36-30493006.pdf; Contact Finish Thickness: 10µin(0.25µm); Features: -; Standard Package: 1; Packaging: Bulk; Datasheet Version: Feb-08; Manufacturer URL: http://www.samtec.com/; Fastening Type: -; Family: RectangularConnectors-Headers,MalePins; Contact Type: MalePin; Color: Black
P2 P3 = USB3140-30-0070-1-C_REVE1: USB-micro B Ñ€Ð°Ð·ÑŠÐµÐ¼ Ñ€Ð¾Ð·ÐµÑ‚ÐºÐ¸ USB 2.0 5-Ð¿Ð¾Ð·Ð¸Ñ†Ð¸Ð¾Ð½Ð½Ð¾Ðµ Ð¿Ð¾Ð²ÐµÑ€Ñ…Ð½Ð¾ÑÑ‚Ð½Ð¾Ðµ ÐºÑ€ÐµÐ¿Ð»ÐµÐ½Ð¸Ðµ, ÑÐºÐ²Ð¾Ð·Ð½Ð¾Ðµ Ð¾Ñ‚Ð²ÐµÑ€ÑÑ‚Ð¸Ðµ; MF: Global Connector Technology; SnapEDA_Link: https://www.snapeda.com/parts/USB3140-30-0070-1-C/Global%20Connector%20Technology/view-part/697013/?ref=snap; Availability: Warning; Price: None; Package: None; Check_prices: https://www.snapeda.com/parts/USB3140-30-0070-1-C/Global%20Connector%20Technology/view-part/697013/?ref=eda; Purchase-URL: https://pricing.snapeda.com/search/part/USB3140-30-0070-1-C/?ref=eda; Value: *; MP: USB3140-30-0070-1-C
R70-R72 R88 = ERJ2RK: as R13 on sheet USB; Published: 17-Dec-2003; LatestRevisionDate: 19-Mar-2004; LatestRevisionNote: Silkscreen size reduced.; PackageDocument: Mar-2003; PackageReference: 2-0402; Publisher: Altium Limited; Code_IPC: 1005 [0402]; ComponentLink1Description: Manufacturer Link; ComponentLink1URL: http://www.panasonic.com/industrial/components/resistive_products.htm; ComponentLink2Description: Datasheet; ComponentLink2URL: http://www.panasonic.com/industrial/components/pdf/AOA0000CE2.pdf
R73 R78 = CMP-2002-07697-1: Part Number: RC0402FR-07470RL; Manufacturer: Yageo / Phycomp
U8 = CMP-0479-00072-2: IC OR CTRLR SRC SELECT 16DFN; Max Output Current: 4A; Operating Supply Current: 44uA; Packaging: Rail/Tube; Max Operating Temperature: 125°C; Min Operating Temperature: -40°C; Number of Pins: 16; Length: 5mm; Package Quantity: 73; Radiation Hardening: No; Series: PowerPath™; RoHS Compliant: Yes; Case/Package: DFN EP; Lead Free: Lead Free
U16 = CMP-09134-000005-1: IC PWR SWITCH P-CHAN 1:1 4WLCSP; Output Configuration: High Side; On-State Resistance: 40mR; Max Input Voltage: 6.5V; Fault Protection: Reverse Current; Min Input Voltage: 1.65V; Output Current per Channel: 1A; Interface: On/Off; Number of Outputs: 1; Operating Supply Current: 1.1uA; Min Operating Temperature: -40°C; Mount: Surface Mount; Lead Free: Contains Lead; Packaging: Tape and Reel; Max Operating Temperature: 85°C; Package Quantity: 3000; RoHS Compliant: Yes; Operating Supply Voltage: 6.5V; Series: -; Output Current: 1A; Number of Pins: 4; Max Output Current: 1A

## Sheet POWERREG.SchDoc
size A3; SheetNumber: 9; SheetTotal: 14; SPICEModelCacheORBVXWHQ: <root> / <DocumentId>ORBVXWHQ</DocumentId> / <CacheFrame Number="0"> / <Model Name="emk105bj105_v-f" Kind="CKT"> / <Text>* EMK105BJ105_V-F     SPICE MODEL  ( General Type ) / *-------------------------------------------------------------------------------------------------------- / * Model Generated by TAIYO YUDEN Corporation (http://www.ty-top.com) / * Version 1.0 / * TAIYO YUDEN Control No. 170508_130520 / * Copyright(c) 2012 TAIYO YUDEN CO.,LTD. All Rights Reserved. / *-------------------------------------------------------------------------------------------------------- / * / * Products Name : Multilayer Ceramic Capacitors / * / * Characteristics : / *     Capacitance : 1 uF , Rated Voltage : 16V , TCC : X5R / *     Case Size : 1.0 x 0.5 / 0.039 x 0.02 [mm/inch] , Thickness : 0.5 / 0.02 [mm/inch] / *     (Conditions: Temperature = 25 degC , DC Bias Current/Voltage = 0A / 0V) / * / * Frequency Range : 40Hz - 3GHz / * / * External Node Assignments : / * / *  1  o---| |---o  2 / * / *-------------------------------------------------------------------------------------------------------- / .SubCkt EMK105BJ105_V-F 1 2 / **************************** / C0 1 110 0.68309u / Cm 1 101 0.26053u / C1 101 102 0.94076u / Rc1 101 102 1.9029k / C2 102 103 0.66707u / Rc2 102 103 120.36 / C3 103 110 0.57203u / Rc3 103 110 2.1097 / C2m 1 301 0.1871u / C21 301 302 3.2494u / Rc21 301 302 1.1117k / C22 302 303 2.1014u / Rc22 302 303 1.484k / C23 303 304 2.1172u / Rc23 303 304 1.3876k / C24 304 305 0.75729u / Rc24 304 305 332.59 / C25 305 306 0.94401u / Rc25 305 306 249.09 / C26 306 307 0.34674u / Rc26 306 307 28.352 / C27 307 308 0.37158u / Rc27 307 308 19.989 / C28 308 309 0.17933u / Rc28 308 309 31.748 / C29 309 110 0.016445u / Rc29 309 110 1.0592 / Rp0 1 110 100Meg / L0 110 120 0.2216n / Lm 120 130 0.1509n / L1 120 121 0.12659n / RL1 121 130 0.85161 / L2 120 122 0.15996n / RL2 122 130 0.42469 / L3 120 123 7.9543n / RL3 123 130 0.54643m / CR 120 124 0.24334u / LR 124 125 0.090738n / RR 125 130 68.076m / CL 130 140 2.7354p / LL 130 140 0.10762n / RL 130 140 50.614 / Rs 140 2 7.5416m / **************************** / .ends EMK105BJ105_V-F</Text> / </Model> / </CacheFrame> / </root>
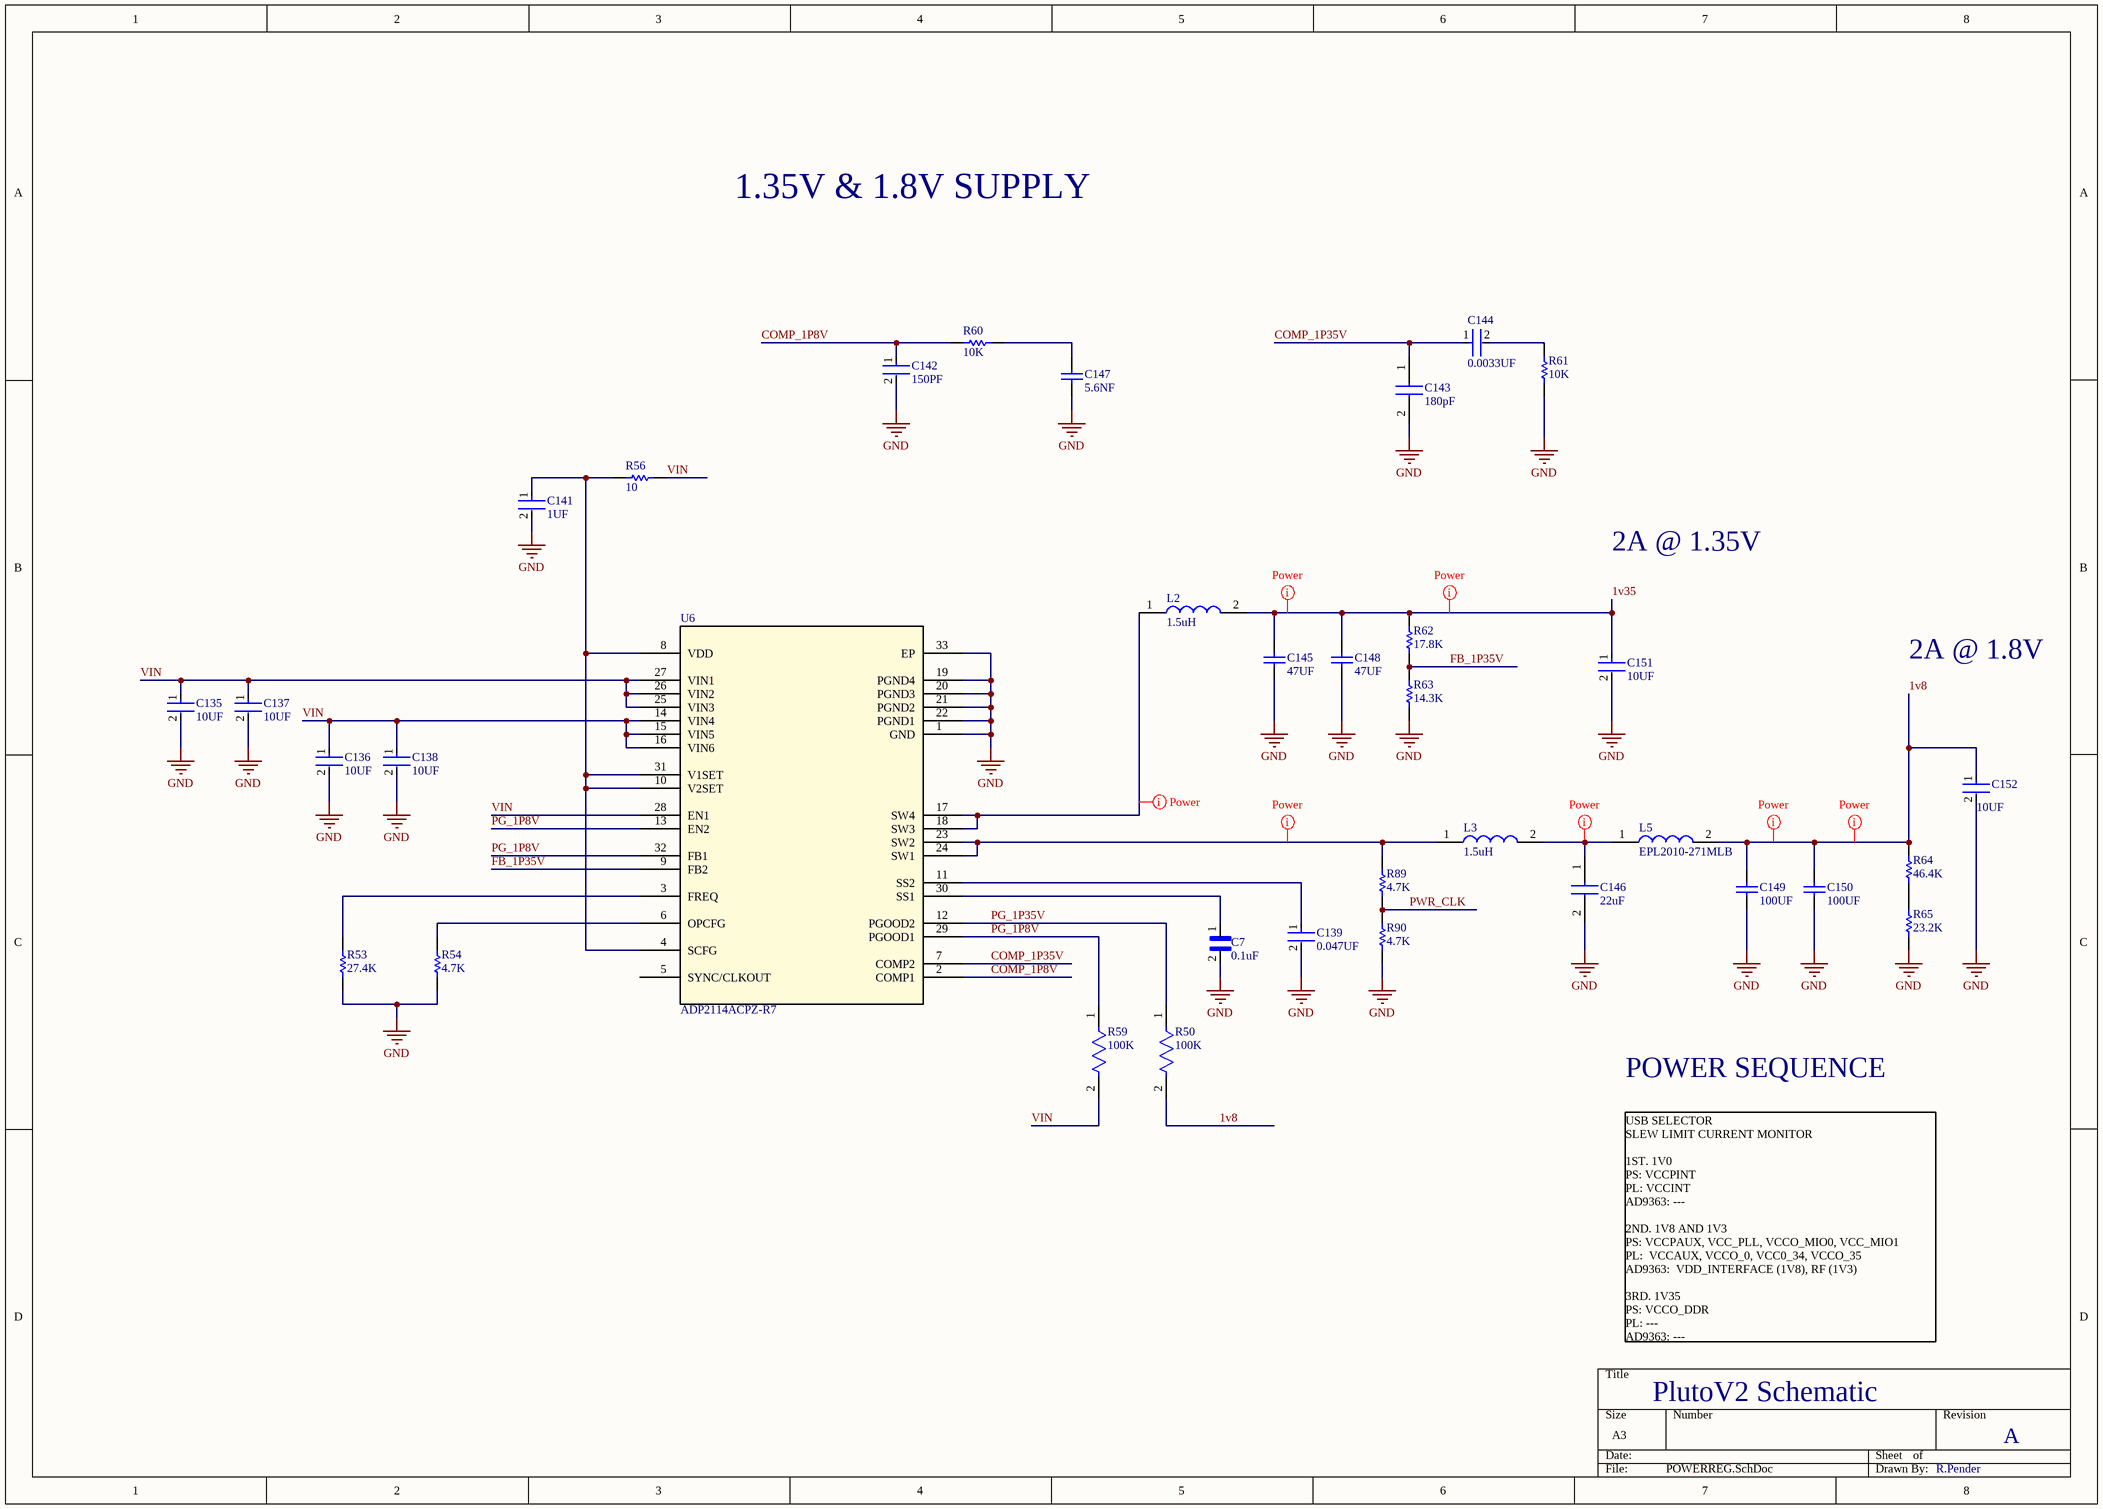
[diagram p8: POWERREG.SchDoc]

### Parts
C7  0.1uF  [CAPC0603X33N]
C135  10UF  [FP-GRM188-0_15-MFG]
C136  10UF  [FP-GRM188-0_15-MFG]
C137  10UF  [FP-GRM188-0_15-MFG]
C138  10UF  [FP-GRM188-0_15-MFG]
C139  0.047UF  [FP-GCM155-0_05-IPC_C]
C141  1UF  [FP-0402-L_1_0_0_05-W_0_5-IPC_A]
C142  150PF  [FP-GCM155-0_05-IPC_C]
C143  180pF  [CAPC1005X55N]
C144  0.0033UF  [FP-CC0402-MFG]
C145  47UF  [TAYO-JMK212BBJ476MG-T_L]
C146  22uF  [CAPC2012X95N]
C147  5.6NF  [CAPC1005X56X25NL10T15]
C148  47UF  [TAYO-JMK212BBJ476MG-T_L]
C149  100UF  [CAPC3216X190X55ML30T25]
C150  100UF  [CAPC3216X190X55ML30T25]
C151  10UF  [FP-GRM188-0_1-e0_2_0_55-IPC_A]
C152  10UF  [FP-GRM188-0_1-e0_2_0_55-IPC_A]
L2  1.5uH  [XFL4020152MEB]
L3  1.5uH  [XFL4020152MEB]
L5  EPL2010-271MLB  [EPL2010271MLB]
R50  100K  [FP-ERJ2RK-IPC_C]
R53  27.4K  [2-0402]
R54  4.7K  [2-0402]
R56  10  [RESC0603X26X15LL03T05]
R59  100K  [FP-ERJ2RK-IPC_C]
R60  10K  [2-0402]
R61  10K  [2-0402]
R62  17.8K  [3-0603]
R63  14.3K  [3-0603]
R64  46.4K  [2-0402]
R65  23.2K  [2-0402]
R89  4.7K  [2-0402]
R90  4.7K  [2-0402]
U6  ADP2114ACPZ-R7  [CP_32_2_ADI]

### Nets
GND: C7.2 C135.2 C136.2 C137.2 C138.2 C139.2 C141.2 C142.2 C143.2 C145.2 C146.2 C147.2 C148.2 C149.2 C150.2 C151.2 C152.2 R53.2 R54.2 R61.2 R63.2 R65.2 R90.2 U6.1(GND) U6.19(PGND4) U6.20(PGND3) U6.21(PGND2) U6.22(PGND1) U6.33(EP)
1v8: C149.1 C150.1 C152.1 L5.2 R50.2 R64.1
1v35: C145.1 C148.1 C151.1 L2.2 R62.1
COMP_1P8V: C142.1 R60.1 U6.2(COMP1)
COMP_1P35V: C143.1 C144.1 U6.7(COMP2)
FB_1P35V: R62.2 R63.1 U6.9(FB2)
PG_1P8V: R59.1 U6.13(EN2) U6.29(PGOOD1) U6.32(FB1)
PG_1P35V: R50.1 U6.12(PGOOD2)
PWR_CLK: R89.2 R90.1
VIN: C135.1 C136.1 C137.1 C138.1 R56.2 R59.2 U6.14(VIN4) U6.15(VIN5) U6.16(VIN6) U6.25(VIN3) U6.26(VIN2) U6.27(VIN1) U6.28(EN1)
NetC7_1: C7.1 U6.30(SS1)
NetC139_1: C139.1 U6.11(SS2)
NetC141_1: C141.1 R56.1 U6.4(SCFG) U6.8(VDD) U6.10(V2SET) U6.31(V1SET)
NetC144_2: C144.2 R61.1
NetC146_1: C146.1 L3.2 L5.1
NetC147_1: C147.1 R60.2
NetL2_1: L2.1 U6.17(SW4) U6.18(SW3)
NetL3_1: L3.1 R89.1 U6.23(SW2) U6.24(SW1)
NetR53_1: R53.1 U6.3(FREQ)
NetR54_1: R54.1 U6.6(OPCFG)
NetR64_2: R64.2 R65.1

Not connected (* = marked no-connect by the designer): U6 5(SYNC/CLKOUT)

### Layout directives
net class Power: 1v8, 1v35, NetC146_1, NetL2_1, NetL3_1

### Notes on the sheet
- 1.35V & 1.8V SUPPLY
- 2A @ 1.35V
- 2A @ 1.8V
- POWER SEQUENCE
- USB SELECTOR                                                                                                    SLEW LIMIT CURRENT MONITOR
  1ST. 1V0
  PS: VCCPINT
  PL: VCCINT
  AD9363: ---
  2ND. 1V8 AND 1V3
  PS: VCCPAUX, VCC_PLL, VCCO_MIO0, VCC_MIO1
  PL:  VCCAUX, VCCO_0, VCC0_34, VCCO_35
  AD9363:  VDD_INTERFACE (1V8), RF (1V3)
  3RD. 1V35
  PS: VCCO_DDR
  PL: ---
  AD9363: ---
- PlutoV2 Schematic
- A
- R.Pender

### Library data of the parts
C7 = GRM033R61C104ME84D: CAP 0.1UF 16VDC X5R 20% SMD 0201 PAPER TAPE; Package: None; Price: None; Value: *; MP: GRM033R61C104ME84D; Availability: Unavailable
C135-C138 = CMP-06035-003612-1: Chip Multilayer Ceramic Capacitors for General Purpose, 0603, 10uF, X5R, 15%, 20%, 10V; Tolerance: 20%; Dielectric: X5R; Package Quantity: 4000; Width: 0.8mm; Case/Package: 0603; Thickness: 0.035inch; Capacitance: 10uF; Voltage Rating: 10V; Voltage Rating (DC): 10V; Termination: SMD/SMT; Length: 1.6mm; Lead Free: Lead Free; Mount: Surface Mount; Height: 0.8mm; Depth: 0.8mm; Packaging: Tape and Reel; Weight: 0.000222oz; Min Operating Temperature: -55°C; Case Code (Metric): 1608; Max Operating Temperature: 85°C; Case Code (Imperial): 0603; Material: Ceramic
C139 = CMP-2008-03720-2: Ceramic Capacitor for Automotive 47nF ±10% 25VDC X7R 0402 Paper T/R; Voltage Rating: 25V; REACH SVHC: No SVHC; Width: 0.02inch; Packaging: Tape and Reel; Case Code (Metric): 1005; Radiation Hardening: No; Voltage: 25V; Length: 1mm; Capacitance: 47nF; Thickness: 0.022inch; Depth: 0.5mm; Termination: SMD/SMT; Dielectric: X7R; Case/Package: 0402; Ratings: AEC-Q200; Voltage Rating (DC): 25V; Mount: Surface Mount; Max Operating Temperature: 125°C; Package Quantity: 1; Tolerance: 10%; Min Operating Temperature: -55°C; Case Code (Imperial): 0402; Height: 0.5mm
C141 = CMP-14477-000104-2: None; Tolerance: 10%; Voltage Rating: 16V; Dielectric: X5R; Packaging: Tape and Reel; Depth: 0.5mm; Mount: Surface Mount; Thickness: 0.022inch; Package Quantity: 1; Min Operating Temperature: -55°C; Series: M; Voltage Rating (DC): 16V; Termination: SMD/SMT; Case/Package: 0402; Number of Pins: 2; Case Code (Imperial): 0402; Capacitance: 1uF; Length: 1mm; Halogen Free: Halogen Free; Case Code (Metric): 1005; Width: 0.02inch; RoHS Compliant: Yes; Radiation Hardening: No; Max Operating Temperature: 85°C; Height: 0.5mm; Construction: Flat
C142 = CMP-06035-010111-1: Ceramic Capacitor for Automotive 150pF ±1% 50VDC C0G 0402 Paper T/R
C143 = CGJ2B2C0G1H181J050BA: Capacitor; Manufacturer_Name: TDK; Datasheet Link: https://product.tdk.com/system/files/dam/doc/product/capacitor/ceramic/mlcc/catalog/mlcc_highreliability_general_en.pdf; Height: 0.55mm; Manufacturer_Part_Number: CGJ2B2C0G1H181J050BA
C144 = CMP-1034-01779-2: CAP CER 3300PF 50V X7R 0402; Manufacturer: YAGEO; Manufacturer Part Number: CC0402KRX7R9BB332; Temperature Coefficient: 30ppm/°C; Material: Ceramic; Value: 3.3 nF; Tolerance: 0.1; Automotive Grade: NA; ComponentLink2Description: Datasheet; ComponentLink2URL: http://www.yageo.com/documents/recent/UPY-GP_NP0_16V-to-50V_16.pdf; Package: CC0402; Temperature Range High: +125°C; Ipc Land Pattern Name: CAPC10050X50; Octopart: https://octopart.com/cc0402krx7r9bb332-yageo-192887; RoHS: TRUE; Automotive: No; Lead Free: Yes; Temperature Characteristic: X7R; Temperature: -55°C to +125°C; Height: 0.55mm; Category: Cap; Footprint Url: http://www.yageo.com/exep/pages/download/literatures/UPY-C_GEN_24.pdf; Device Class L2: Capacitors; Device Class L3: Ceramic Capacitors; Digikey Description: CAP CER 3300PF 50V X7R 0402; Temperature Range Low: -55°C; Voltage Rating: 50 V; Mouser Description: Multilayer Ceramic Capacitors MLCC - SMD/SMT 3.3nF 50V X7R 10%; Device Class L1: Passive Components; Capacitance: 3.3 nF
C145 C148 = CMP-2000-06498-1: High Value Multilayer Ceramic Capacitor, 47 uF, +/-20%, 6.3 V, -55 to 85 degC, 2-Pin SMD (0805), RoHS, Tape and Reel; Manufacturer: Taiyo Yuden; PCN Part Number: X5R,X7RDielectrics23/Jan/2008; Kits: 587-1797-KIT-ND-KITCAPCERHICAP0603&0805S; Temperature Coefficient: X5R; Tolerance: ±20%; Online Catalog: MSeries; Other Names: 587-1779-1; Capacitance: 47µF; Voltage - Rated: 6.3V; Catalog Drawings: xMKSeries_0805_1.25; Operating Temperature: -55°C~85°C; Mounting Technology: SurfaceMount; Package Reference: 0805; Features: -; Lead Spacing: -; Lead Style: -; Family: CeramicCapacitors; Size / Dimension: 0.079"Lx0.049"W(2.00mmx1.25mm); Package Description: 2-Pin SMD, Body 2.2 x 1.45 mm; Mounting Type: SurfaceMount,MLCC; Package / Case: 0805(2012Metric); Series: M; Category: Capacitors; Packaging: CutTape(CT); Datasheet Version: 10/2015; Datasheet URL: http://datasheet.octopart.com/JMK212BJ476MG-T-Taiyo-Yuden-datasheet-62109412.pdf; Manufacturer URL: http://www.t-yuden.com/; Ratings: -; Height - Seated (Max): -; Standard Package: 1; Thickness (Max): 0.053"(1.35mm); Applications: GeneralPurpose
C146 = CL21A226KPCLRNC: Capacitor; Manufacturer_Name: Samsung Electro-Mechanics; Datasheet Link: https://datasheet.datasheetarchive.com/originals/distributors/DKDS-19/374283.pdf; Height: 0.95mm; Manufacturer_Part_Number: CL21A226KPCLRNC
C147 = CMP-2008-02976-1: Manufacturer: AVX Interconnect / Elco; Part Number: 04025C562JAT2A
C149 C150 = CMP-1662-00011-2: Chip Capacitor, 100 uF, +/- 20%, 6.3 V, -55 to 85 degC, 1206 (3216 Metric), RoHS, Tape and Reel; PartNumber: GRM31CR60J107ME39L; Case\/Package: 1206; Voltage Rating (DC): 6.3 V; Type (Capacitors): X5R; REACH SVHC: No SVHC; Height: 1.6 mm; Tolerance: 20%; Packaging: Tape and Reel; Mount: Surface Mount; PackageDescription: 2-Pin Surface Mount Device, Body 3.2 x 1.6 mm; ComponentLink1URL: http://www.murata.com/; Pins: 2; ComponentLink2Description: Datasheet; PackageReference: 1206; Width: 1.6 mm; Package Quantity: 2000; Capacitance: 100 uF; Min Operating Temperature: -55 degC; Case Code (Imperial): 1206; Max Operating Temperature: 85 degC; DatasheetVersion: 09/2016; Mounting Technology: Surface Mount; Voltage Rating: 6.3 V; ComponentLink1Description: Manufacturer URL; Radiation Hardening: No; Case Code (Metric): 3216; Length: 3.2 mm; ComponentLink2URL: http://psearch.en.murata.com/capacitor/product/GRM31CR60J107ME39%23.pdf; RoHSCompliant: true
C151 C152 = CMP-2006-02792-2: Chip Multilayer Ceramic Capacitors for General Purpose, 0603, 10uF, X5R, 15%, 20%, 6.3V; Packaging: Tape and Reel; Voltage Rating (DC): 6.3V; Width: 0.031inch; Termination: SMD/SMT; Dielectric: X5R; Package Quantity: 4000; Voltage Rating: 6.3V; Capacitance: 10uF; Case/Package: 0603; Min Operating Temperature: -55°C; Voltage: 6.3V; Length: 1.6mm; Thickness: 0.035inch; Lead Free: Lead Free; Depth: 0.8mm; Case Code (Imperial): 0603; Max Operating Temperature: 85°C; Material: Ceramic; Height: 0.8mm; Tolerance: 20%; Mount: Surface Mount; REACH SVHC: No SVHC; Radiation Hardening: No; Case Code (Metric): 1608
L2 L3 = XFL4020-152MEB: Inductor; Manufacturer_Name: COILCRAFT; Datasheet Link: https://componentsearchengine.com//XFL4020-152MEB.pdf; Height: 2.1mm; Mouser2 Part Number: 994-XFL4020-152MEB; Mouser2 Price/Stock: https://www.mouser.com/Search/Refine.aspx?Keyword=994-XFL4020-152MEB; Manufacturer_Part_Number: XFL4020-152MEB
L5 = EPL2010-271MLB: Inductor; Manufacturer_Name: COILCRAFT; Datasheet Link: https://componentsearchengine.com/Datasheets/2/EPL2010-271MLB.pdf; Height: 1.05mm; Manufacturer_Part_Number: EPL2010-271MLB
R50 R59 = CMP-2002-00608-4: RES SMD 100K OHM 1% 1/10W 0402; Resistance: 100kR; Voltage Rating (DC): 50V; Power Rating: 100mW; Temperature Coefficient: 100ppm/°C; Case/Package: 0402; Length: 1mm; Package Quantity: 1; Radiation Hardening: No; Case Code (Metric): 1005; Contact Plating: Tin; Mount: Surface Mount; Depth: 0.5mm; Max Operating Temperature: 155°C; Lead Free: Lead Free; Width: 0.5mm; Composition: Thick Film; Case Code (Imperial): 0402; Tolerance: 1%; Termination: SMD/SMT; Number of Pins: 2; Height: 0.35mm; Voltage Rating: 50V; Military Standard: Not; REACH SVHC: No SVHC; Packaging: Tape and Reel; Min Operating Temperature: -55°C; Max Power Dissipation: 100mW; Features: Automotive AEC-Q200; Number of Terminations: 2
R53 R54 R60 R61 R64 R65 R89 R90 = ERJ2RK: Precision Thick Film Chip Resistor, 10 Ohm to 1M Ohm Range, 1% and 0.5% Tolerance, 0402 Size, 0.063 W; Published: 17-Dec-2003; LatestRevisionDate: 19-Mar-2004; LatestRevisionNote: Silkscreen size reduced.; PackageDocument: Mar-2003; PackageReference: 2-0402; Publisher: Altium Limited; Code_IPC: 1005 [0402]; ComponentLink1Description: Manufacturer Link; ComponentLink1URL: http://www.panasonic.com/industrial/components/resistive_products.htm; ComponentLink2Description: Datasheet; ComponentLink2URL: http://www.panasonic.com/industrial/components/pdf/AOA0000CE2.pdf
R56 = CMP-2004-03448-1: Manufacturer: Panasonic; Part Number: ERJ1GNF10R0C
R62 R63 = ERJ3EK: Precision Thick Film Chip Resistor, 10 Ohm to 1M Ohm Range, 1% and 0.5% Tolerance, 0603 Size, 0.063 W; Published: 17-Dec-2003; LatestRevisionDate: 19-Mar-2004; LatestRevisionNote: Silkscreen size reduced.; PackageDocument: Mar-2003; PackageReference: 3-0603; Publisher: Altium Limited; Code_IPC: 1608 [0603]; ComponentLink1Description: Manufacturer Link; ComponentLink1URL: http://www.panasonic.com/industrial/components/resistive_products.htm; ComponentLink2Description: Datasheet; ComponentLink2URL: http://www.panasonic.com/industrial/components/pdf/AOA0000CE2.pdf
U6 = ADP2114ACPZ-R7: No Description Available; Mfr_Name: Analog Devices Inc; Copyright: Copyright (C) 2022 Ultra Librarian. All rights reserved.; Manufacturer_Part_Number: ADP2114ACPZ-R7; Digi-Key_Part_Number_1: ADP2114ACPZ-R7CT-ND; Digi-Key_Part_Number_2: ADP2114ACPZ-R7DKR-ND; Digi-Key_Part_Number_3: ADP2114ACPZ-R7TR-ND; Digi-Key_Part_Number_4: 2156-ADP2114ACPZ-R7-ND; RefDes: RefDes; Type: DEV